# EasyEDA Pro project STM32_Temperature_Control.epro

# Schematic Schematic1
Board Name: Board1; Create Date: 2025-11-11; Page Name: P1; Project Name: 无线杯B题-智能温控; Schematic Name: Schematic1; Update Date: 2025-11-17; Company: 嘉立创EDA; Page Size: A4; Version: V1.0
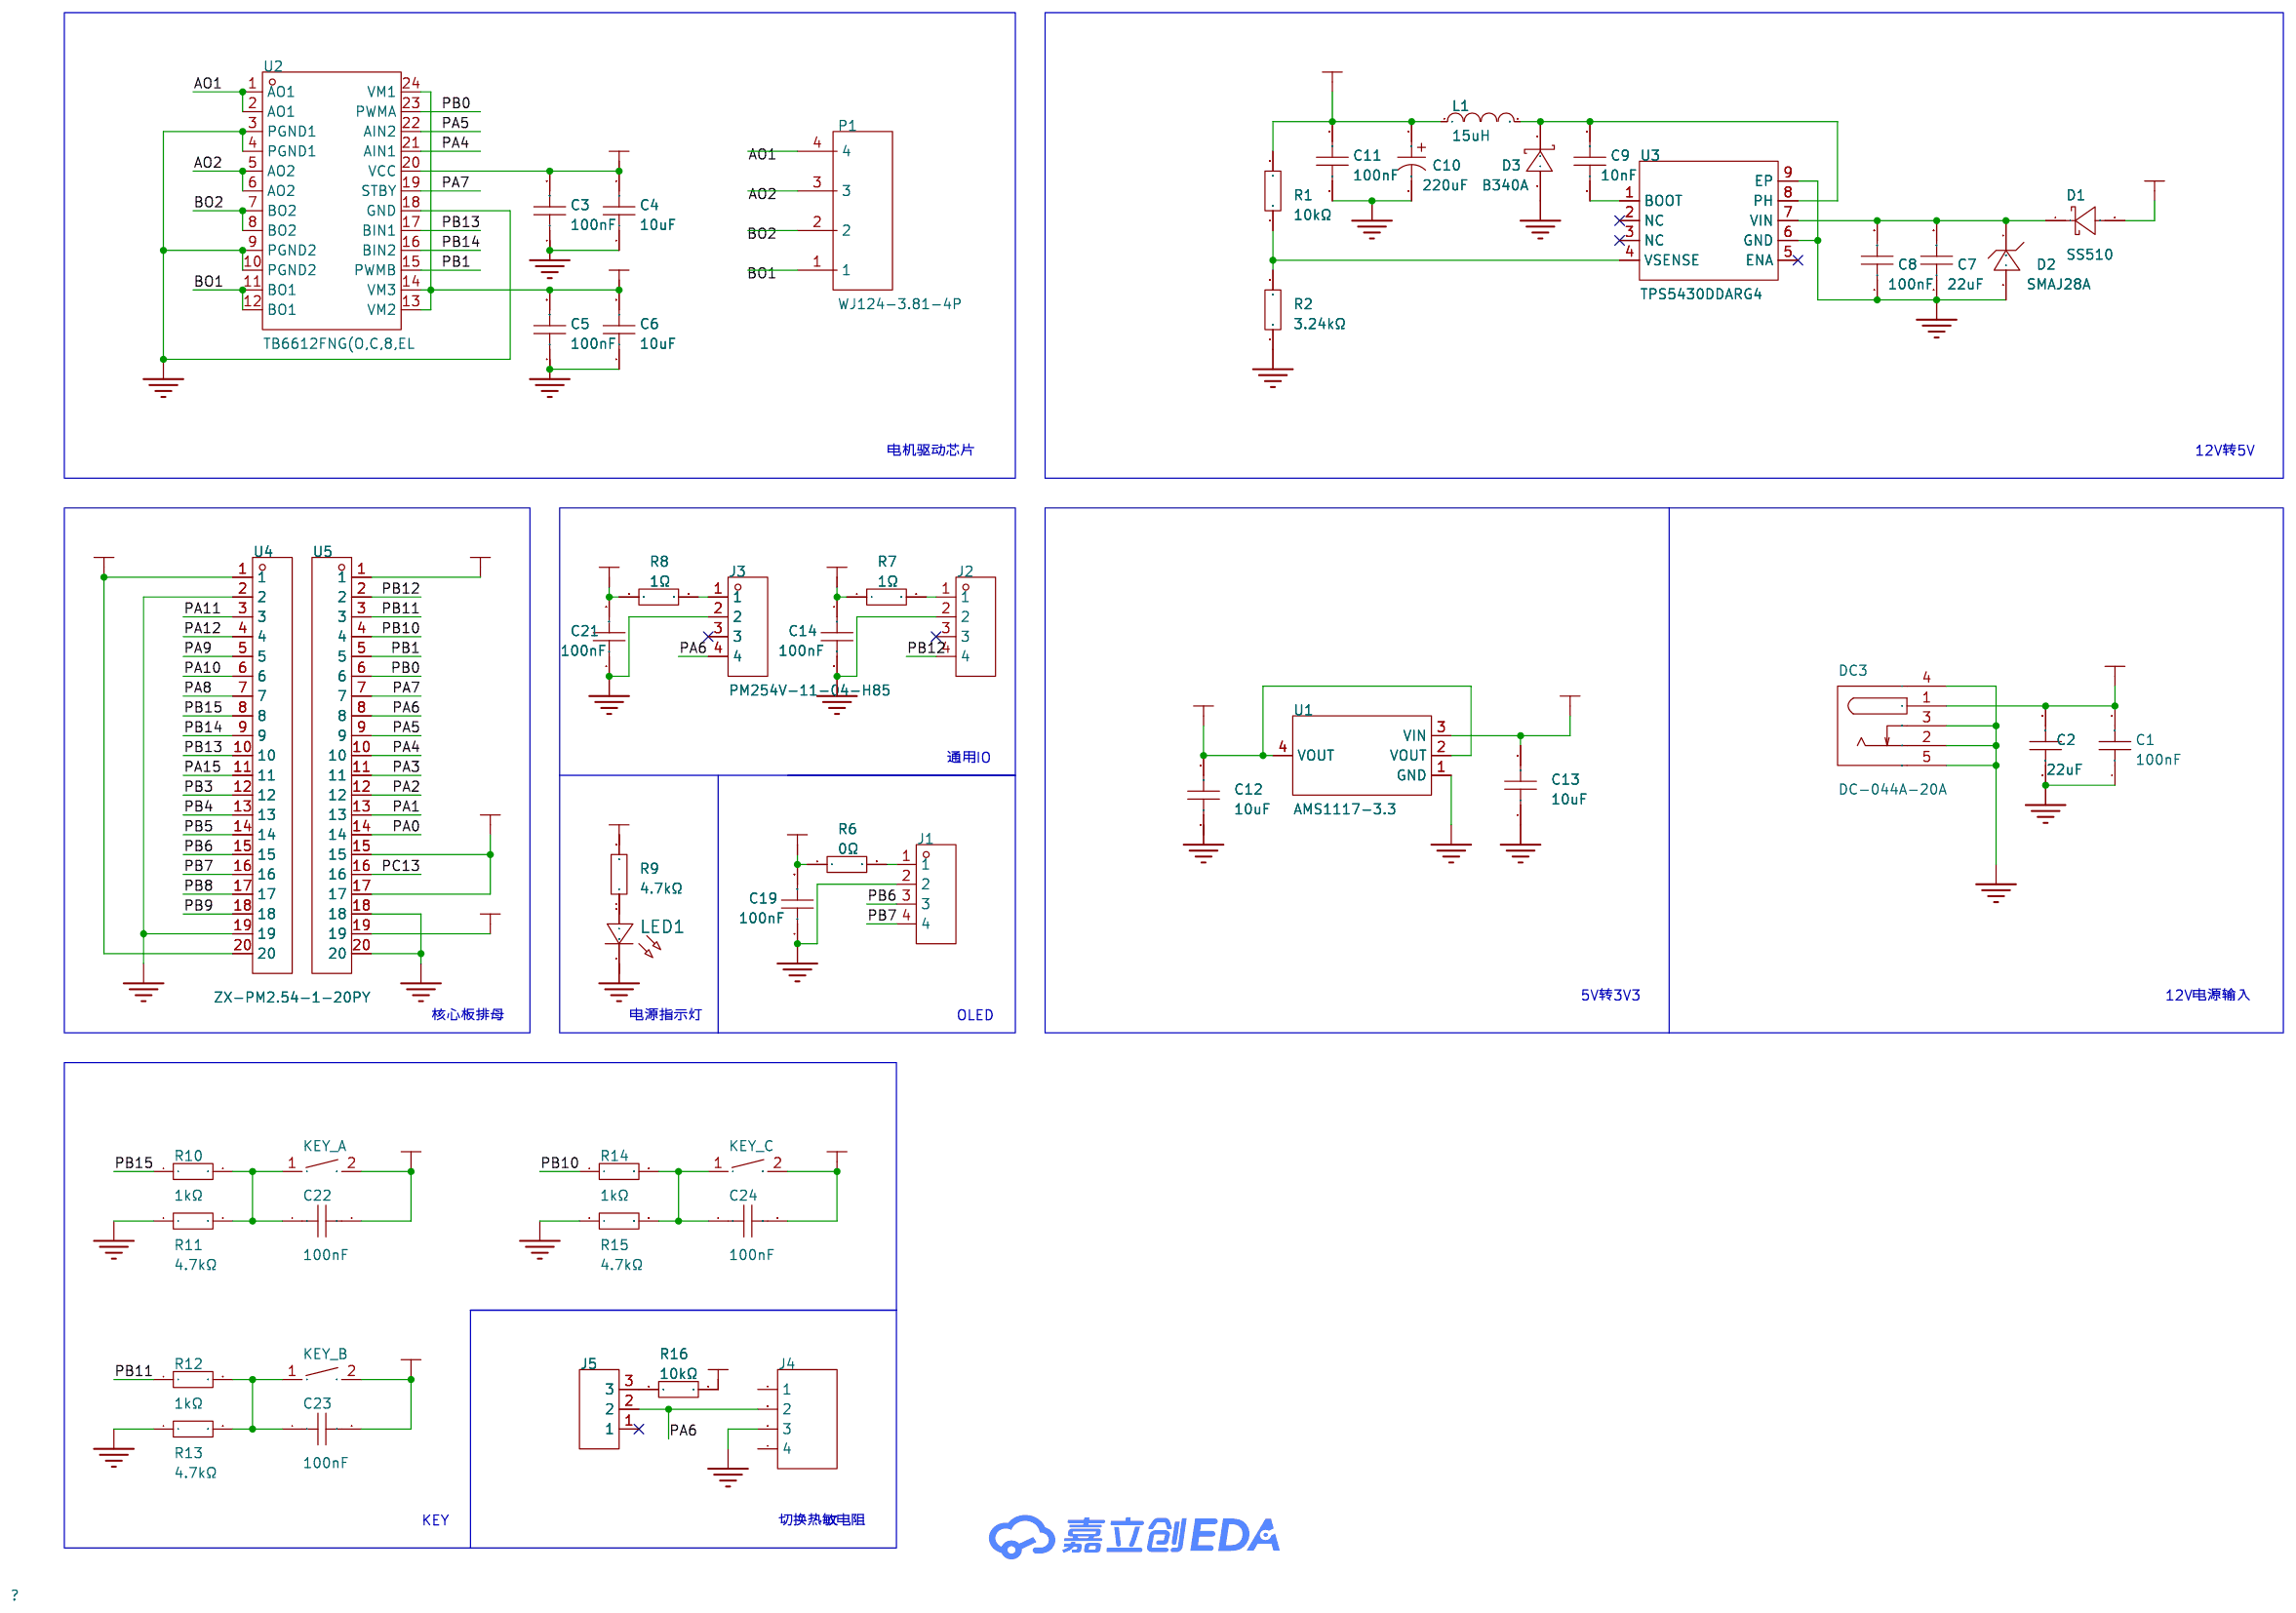
[diagram p0: schematic sheet]

## Parts
C1  100nF  [C0805]
C2  22uF  [C0805]
C3  100nF  [C0805]
C4  10uF  [C0805]
C5  100nF  [C0805]
C6  10uF  [C0805]
C7  22uF  [C0805]
C8  100nF  [C0805]
C9  10nF  [C0603]
C10  220uF  [CAP-TH_BD6.3-P2.50-D0.5-FD]
C11  100nF  [C0805]
C12  10uF  [C0805]
C13  10uF  [C0805]
C14  100nF  [C0805]
C19  100nF  [C0805]
C21  100nF  [C0805]
C22  100nF  [C0805]
C23  100nF  [C0805]
C24  100nF  [C0805]
D1  SS510  [SMB_L4.3-W3.6-LS5.4-RD]
D2  SMAJ28A  [SMA_L4.4-W2.6-LS5.0-RD]
D3  B340A  [SMA_L4.3-W2.6-LS5.1-RD]
DC3  DC-044A-20A  [DC-IN-TH_DC-044A-20A]
J1  PM254V-11-04-H85  [HDR-TH_4P-P2.54-V-F]
J2  PM254V-11-04-H85  [HDR-TH_4P-P2.54-V-F]
J3  PM254V-11-04-H85  [HDR-TH_4P-P2.54-V-F]
J4  B-2100S04P-A110  [HDR-TH_4P-P2.54-V-M]
J5  PZ254V-11-03P  [HDR-TH_3P-P2.54-V-M]
KEY_A  HX 3x4x2-2P-1.6N TACTILE SWITCH  [KEY-SMD_L4.0-W3.0-LS4.9-1]
KEY_B  HX 3x4x2-2P-1.6N TACTILE SWITCH  [KEY-SMD_L4.0-W3.0-LS4.9-1]
KEY_C  HX 3x4x2-2P-1.6N TACTILE SWITCH  [KEY-SMD_L4.0-W3.0-LS4.9-1]
L1  15uH  [IND-SMD_L7.0-W6.6_FXL0630]
LED1  LS R976-NR-1-0-20-R18  [LED0805-RD_RED]
P1  WJ124-3.81-4P  [CONN-TH_4P-P3.81_KF124-3.81-4P]
R1  10kΩ  [R0805]
R2  3.24kΩ  [R0805]
R6  0Ω  [R0603]
R7  1Ω  [R0603]
R8  1Ω  [R0603]
R9  4.7kΩ  [R0805]
R10  1kΩ  [R0805]
R11  4.7kΩ  [R0805]
R12  1kΩ  [R0805]
R13  4.7kΩ  [R0805]
R14  1kΩ  [R0805]
R15  4.7kΩ  [R0805]
R16  10kΩ  [R0805]
U1  AMS1117-3.3  [SOT-223-3_L6.5-W3.4-P2.30-LS7.0-BR]
U2  TB6612FNG(O,C,8,EL  [SSOP-24_L8.4-W5.8-P0.65-LS7.8-BL]
U3  TPS5430DDARG4  [SO-8_L4.9-W3.9-P1.27-LS6.0-BL-EP]
U4  ZX-PM2.54-1-20PY  [HDR-TH_20P-P2.54-V-F]
U5  ZX-PM2.54-1-20PY  [HDR-TH_20P-P2.54-V-F]

## Library data of the parts
C1 C3 C5 C8 C11 C14 C19 C21-C24 = CL21B104KBCNNNC: 容值:100nF;精度:±10%;额定电压:50V;温度系数:X7R;; LCSC Part Name: 100nF ±10% 50V; Supplier Part: C1711; Manufacturer: SAMSUNG(三星); Supplier Footprint: 0805; JLCPCB Part Class: Extended Part; Datasheet: https://item.szlcsc.com/datasheet/CL21B104KBCNNNC/2063.html; Supplier: LCSC; Tolerance: ±10%; Voltage Rating: 50V; Temperature Coefficient: X7R
C2 C7 = CL21A226MAQNNNE: 容值:22uF;精度:±20%;额定电压:25V;温度系数:X5R;; LCSC Part Name: 22uF ±20% 25V; Supplier Part: C45783; Manufacturer: SAMSUNG(三星); Supplier Footprint: 0805; JLCPCB Part Class: Basic Part; Datasheet: https://item.szlcsc.com/datasheet/CL21A226MAQNNNE/46786.html; Supplier: LCSC; Tolerance: ±20%; Voltage Rating: 25V; Temperature Coefficient: X5R
C4 C6 C12 C13 = GRM21BR61H106KE43L: 容值:10uF;精度:±10%;额定电压:50V;温度系数:X5R;; LCSC Part Name: 10uF ±10% 50V; Supplier Part: C440198; Manufacturer: muRata(村田); Supplier Footprint: 0805; JLCPCB Part Class: 基础库; Datasheet: https://item.szlcsc.com/datasheet/GRM21BR61H106KE43L/439567.html; Supplier: LCSC; Tolerance: ±10%; Voltage Rating: 50V; Temperature Coefficient: X5R
C9 = 0603B103K500NT: 容值:10nF;精度:±10%;额定电压:50V;温度系数:X7R;; LCSC Part Name: 10nF ±10% 50V; Supplier Part: C57112; Manufacturer: FH(风华); Supplier Footprint: 0603; JLCPCB Part Class: Basic Part; Datasheet: https://item.szlcsc.com/datasheet/0603B103K500NT/58143.html; Supplier: LCSC; Tolerance: ±10%; Voltage Rating: 50V; Temperature Coefficient: X7R
C10 = ERG25V220M6X11: 容值:220uF;精度:±20%;额定电压:25V;纹波电流:510mA@100kHz;等效串联电阻(ESR):130mΩ@100kHz;; LCSC Part Name: 220uF ±20% 25V; Supplier Part: C47344177; Manufacturer: JIERR(捷而瑞); Supplier Footprint: 插件,D6.3xL11mm; JLCPCB Part Class: 扩展库; Datasheet: https://item.szlcsc.com/datasheet/ERG25V220M6X11/49556618.html; Supplier: LCSC; Tolerance: ±20%; Voltage Rating: 25V; Ripple Current: 510mA@100kHz; Equivalent Series Resistance(ESR): 130mΩ@100kHz; Pin Spacing: 2.5mm; Diameter: 6mm; Height - Seated (Max): 11mm; Lifetime: 2000hrs@105℃; Operating Temperature: -40℃~+105℃
D1 = SS510: 二极管配置:独立式;正向压降(Vf):850mV@5A;直流反向耐压(Vr):100V;整流电流:5A;; LCSC Part Name: 电压:100V 电流:5A; Supplier Part: C2898359; Manufacturer: YFW(佑风微); Supplier Footprint: SMB; JLCPCB Part Class: 扩展库; Datasheet: https://item.szlcsc.com/datasheet/SS510/3145887.html; Supplier: LCSC; Diode Configuration: 独立式; Voltage - Forward(Vf@If): 850mV@5A; Voltage - DC Reverse(Vr): 100V; Current - Rectified: 5A; Reverse Leakage Current (Ir): 300uA@100V
D2 = SMAJ28A: 极性:单向;反向截止电压(Vrwm):28V;钳位电压:45.4V;峰值脉冲电流(Ipp):8.8A;峰值脉冲功率(Ppp):400W@10/1000us;击穿电压:31.1V;; LCSC Part Name: 单向TVS 28V截止 峰值脉冲电流：8.8A; Supplier Part: C397697; Manufacturer: AnBon(安邦); Supplier Footprint: SMA(DO-214AC); JLCPCB Part Class: 扩展库; Datasheet: https://item.szlcsc.com/datasheet/SMAJ28A/379220.html; Supplier: LCSC; Polarity: 单向; Reverse Stand-Off Voltage (Vrwm): 28V; Clamping Voltage: 45.4V; Peak Pulse Current (Ipp): 8.8A; Peak Pulse Power Dissipation (Ppp): 400W@10/1000us; Voltage - Breakdown: 31.1V; Reverse Leakage Current (Ir): 5uA; Operating Temperature: -55℃~+150℃; Type: TVS
D3 = B340A: 二极管配置:独立式;正向压降(Vf):550mV@3A;直流反向耐压(Vr):40V;整流电流:3A;; LCSC Part Name: 电压:40V 电流:3A; Supplier Part: C64982; Manufacturer: MDD(辰达半导体); Supplier Footprint: SMA(DO-214AC); JLCPCB Part Class: 扩展库; Datasheet: https://item.szlcsc.com/datasheet/B340A/66052.html; Supplier: LCSC; Diode Configuration: 独立式; Voltage - Forward(Vf@If): 550mV@3A; Voltage - DC Reverse(Vr): 40V; Current - Rectified: 3A; Reverse Leakage Current (Ir): 500uA@40V; Operating Junction Temperature Range: -50℃~+150℃
DC3 = DC-044A-20A: 连接器类型:DC电源插座;安装方式:弯插;触点内径:2mm;触点外径:5.9mm;额定电流:5A;额定电压:30V;工作温度:-20℃~+70℃;; LCSC Part Name: DC电源插座 内径:2mm 外径:5.9mm; Supplier Part: C129006; Manufacturer: 韩国韩荣; Supplier Footprint: 插件; JLCPCB Part Class: 扩展库; Datasheet: https://item.szlcsc.com/datasheet/DC-044A-20A/140292.html; Supplier: LCSC; Connector Type: DC电源插座; Mounting Type: 弯插; Inside Contact Diameter: 2mm; Outside Contact Diameter: 5.9mm; Current Rating: 5A; Voltage Rating (Max): 30V; Operating Temperature: -20℃~+70℃
J1-J3 = PM254V-11-04-H85: 插孔结构:1x4P;间距:2.54mm;行距:-;圆孔/方孔:方孔;安装方式:直插;排数:单排;总孔位数:4P;额定电流:3A;插孔方向:顶部;塑高:8.5mm;触头材质:黄铜;触头镀层:-;工作温度:-40℃~+105℃;; LCSC Part Name: 1x4P 间距:2.54mm 直插; Supplier Part: C541851; Manufacturer: XFCN(兴飞); Supplier Footprint: 插件,P=2.54mm; JLCPCB Part Class: 扩展库; Datasheet: https://item.szlcsc.com/datasheet/PM254V-11-04-H85/562472.html; Supplier: LCSC; Holes Structure: 1x4P; Pitch: 2.54mm; Circular Hole / Square Hole: 方孔; Mounting Type: 直插; Number of Rows: 单排; Number of Positions: 4P; Current Rating: 3A; Holes Direction: 顶部; Insulation Height: 8.5mm; Contact Material: 黄铜; Operating Temperature: -40℃~+105℃
J4 = B-2100S04P-A110: 插针结构:1x4P;间距:2.54mm;行距:-;圆针/方针:-;安装方式:直插;排数:单排;总PIN位数:4P;额定电流:-;额定电压:-;配合针长度:6mm;塑高:2.54mm;端接针长度:3mm;触头材质:黄铜;触头镀层:-;工作温度:-40℃~+105℃;颜色:黑色;; LCSC Part Name: 1x4P 间距:2.54mm 直插; Supplier Part: C124378; Manufacturer: Ckmtw(灿科盟); Supplier Footprint: 插件,P=2.54mm; JLCPCB Part Class: 扩展库; Datasheet: https://item.szlcsc.com/datasheet/B-2100S04P-A110/125653.html; Supplier: LCSC; Pin Structure: 1x4P; Pitch: 2.54mm; Mounting Type: 直插; Number of Rows: 单排; Number of Pins: 4P; Length of Mating Pin: 6mm; Insulation Height: 2.54mm; Length of End Connection Pin: 3mm; Contact Material: 黄铜; Operating Temperature: -40℃~+105℃; Color: 黑色
J5 = PZ254V-11-03P: 插针结构:1x3P;间距:2.54mm;行距:-;圆针/方针:方针;安装方式:直插;排数:单排;总PIN位数:3P;额定电流:3A;额定电压:250V;配合针长度:6mm;塑高:2.5mm;端接针长度:3mm;工作温度:-40℃~+105℃;颜色:黑色;; LCSC Part Name: 1x3P 间距:2.54mm 方针 直插; Supplier Part: C2937625; Manufacturer: XFCN(兴飞); Supplier Footprint: 插件,P=2.54mm; JLCPCB Part Class: 扩展库; Datasheet: https://item.szlcsc.com/datasheet/PZ254V-11-03P/3293280.html; Supplier: LCSC; Pin Structure: 1x3P; Pitch: 2.54mm; Circluar Pins/Square Pins: 方针; Mounting Type: 直插; Number of Rows: 单排; Number of Pins: 3P; Current Rating: 3A; Voltage Rating (Max): 250V; Length of Mating Pin: 6mm; Insulation Height: 2.5mm; Length of End Connection Pin: 3mm; Operating Temperature: -40℃~+105℃; Color: 黑色
KEY_A KEY_B KEY_C = HX 3x4x2-2P-1.6N TACTILE SWITCH: 电路结构:单刀单掷;按钮形状:圆形按钮;作用力:1.6N;安装方式:立贴;开关长度:4mm;开关宽度:3mm;开关高度:2mm;带支架:不带支架;触点电流:50mA;额定电压:12V;带灯:无;工作寿命:10万次;; LCSC Part Name: 4*3*2mm 立贴 轻触开关; Supplier Part: C49234124; Manufacturer: hanxia(韩下); Supplier Footprint: SMD; JLCPCB Part Class: 扩展库; Datasheet: https://item.szlcsc.com/datasheet/HX%25203x4x2-2P-1.6N%2520TACTILE%2520SWITCH/51650185.html; Supplier: LCSC; Circuit: 单刀单掷; Actuator Style: 圆形按钮; Operating Force: 1.6N; Mounting Type: 立贴; Length: 4mm; Width: 3mm; Switch Height: 2mm; with Bracket: 不带支架; Contact Current: 50mA; Voltage Rating: 12V; Actuator/Cap Color: 黑色; With Lamp: 无; Termination Style: SMD接片; Life: 10万次
L1 = FXL0630-150-M: 电感值:15uH;精度:±20%;额定电流:3A;饱和电流(Isat):4A;类型:一体成型电感;; LCSC Part Name: 15uH ±20%; Supplier Part: C177243; Manufacturer: cjiang(长江微电); Supplier Footprint: SMD,6.6x7mm; JLCPCB Part Class: 扩展库; Datasheet: https://item.szlcsc.com/datasheet/FXL0630-150-M/188635.html; Supplier: LCSC; Tolerance: ±20%; Current Rating: 3A; Current - Saturation(Isat): 4A; DC Resistance(DCR): 115mΩ; Type: 一体成型电感
LED1 = LS R976-NR-1-0-20-R18: LCSC Part Name: 0805红(雾状); Supplier Part: C2899997; Manufacturer: OSRAM(欧司朗); Supplier Footprint: 0805; JLCPCB Part Class: Extended Part; Datasheet: https://item.szlcsc.com/datasheet/LS%2520R976-NR-1-0-20-R18/3147924.html; Supplier: LCSC
P1 = WJ124-3.81-4P: 结构:1x4P;间距:3.81mm;颜色:绿色;安装方式:直插;排数:1;每排PIN数:4;额定电流:15A;额定电压:300V;线规 - AWG:14~30;线规 - 平方毫米:1.5;工作温度:-40℃~+105℃;; LCSC Part Name: 3.81mm 1x4P 排数:1 每排P数:4 直插; Supplier Part: C69809; Manufacturer: KANGNEX(康奈克斯电气); Supplier Footprint: 插件,P=3.81mm; JLCPCB Part Class: 扩展库; Datasheet: https://item.szlcsc.com/datasheet/WJ124-3.81-4P/70903.html; Supplier: LCSC; Number of Positions or Pins: 1x4P; Pitch: 3.81mm; Color: 绿色; Mounting Type: 直插; Number of Pins: 4P; Number of Rows: 1; Number of PINs Per Row: 4; Current Rating: 15A; Voltage Rating (Max): 300V; Wire Gauge - AWG: 14~30; Wire Gauge - mm2: 1.5; Operating Temperature: -40℃~+105℃
R1 R16 = 0805W8F1002T5E_C17414: 电阻类型:厚膜电阻;阻值:10kΩ;精度:±1%;功率:125mW;工作电压:150V;温度系数:±100ppm/℃;; LCSC Part Name: 10kΩ ±1% 125mW 厚膜电阻; Supplier Part: C17414; Manufacturer: UNI-ROYAL(厚声); Manufacturer Part: 0805W8F1002T5E; Supplier Footprint: 0805; JLCPCB Part Class: Basic Part; Datasheet: https://item.szlcsc.com/datasheet/0805W8F1002T5E/18102.html; Supplier: LCSC; Type: 厚膜电阻; Tolerance: ±1%; Power(Watts): 125mW; Voltage-Supply(Max): 150V; Temperature Coefficient: ±100ppm/℃; Operating Temperature: -55℃~+155℃
R2 = FRC0805F3241TS: 电阻类型:厚膜电阻;阻值:3.24kΩ;精度:±1%;功率:125mW;工作电压:150V;温度系数:±100ppm/℃;; LCSC Part Name: 3.24kΩ ±1% 125mW 厚膜电阻; Supplier Part: C2933414; Manufacturer: FOJAN(富捷); Supplier Footprint: 0805; JLCPCB Part Class: Extended Part; Supplier: LCSC; Type: 厚膜电阻; Tolerance: ±1%; Power(Watts): 125mW; Voltage-Supply(Max): 150V; Temperature Coefficient: ±100ppm/℃; Operating Temperature: -55℃~+155℃
R6 = 0603WAF0000T5E: 电阻类型:厚膜电阻;阻值:0Ω;精度:±1%;功率:100mW;工作电压:75V;温度系数:-;; LCSC Part Name: 0Ω ±1% 100mW 厚膜电阻; Supplier Part: C21189; Manufacturer: UNI-ROYAL(厚声); Supplier Footprint: 0603; JLCPCB Part Class: Basic Part; Datasheet: https://item.szlcsc.com/datasheet/0603WAF0000T5E/21903.html; Supplier: LCSC; Type: 厚膜电阻; Tolerance: ±1%; Power(Watts): 100mW; Voltage-Supply(Max): 75V; Operating Temperature: -55℃~+155℃
R7 R8 = 0603WAF100KT5E: 电阻类型:厚膜电阻;阻值:1Ω;精度:±1%;功率:100mW;工作电压:75V;温度系数:±400ppm/℃;; LCSC Part Name: 1Ω ±1% 100mW 厚膜电阻; Supplier Part: C22936; Manufacturer: UNI-ROYAL(厚声); Supplier Footprint: 0603; JLCPCB Part Class: Basic Part; Datasheet: https://item.szlcsc.com/datasheet/0603WAF100KT5E/23663.html; Supplier: LCSC; Type: 厚膜电阻; Tolerance: ±1%; Power(Watts): 100mW; Voltage-Supply(Max): 75V; Temperature Coefficient: ±400ppm/℃; Operating Temperature: -55℃~+155℃
R9 R11 R13 R15 = 0805W8F4701T5E: 电阻类型:厚膜电阻;阻值:4.7kΩ;精度:±1%;功率:125mW;最大工作电压:150V;温度系数:±100ppm/℃;; LCSC Part Name: 4.7kΩ ±1% 125mW 厚膜电阻; Supplier Part: C17673; Manufacturer: UNI-ROYAL(厚声); Supplier Footprint: 0805; JLCPCB Part Class: Basic Part; Datasheet: https://atta.szlcsc.com/upload/public/pdf/source/20200306/C422600_1E6D84923E4A46A82E41ADD87F860B5C.pdf; Supplier: LCSC; Type: 厚膜电阻; Tolerance: ±1%; Power(Watts): 125mW; Overload Voltage (Max): 150V; Temperature Coefficient: ±100ppm/℃; Operating Temperature Range: -55℃~+155℃; Voltage-Supply(Max): 150V
R10 R12 R14 = 0805W8F1001T5E: 电阻类型:厚膜电阻;阻值:1kΩ;精度:±1%;功率:125mW;最大工作电压:150V;温度系数:±100ppm/℃;; LCSC Part Name: 1kΩ ±1% 125mW 厚膜电阻; Supplier Part: C17513; Manufacturer: UNI-ROYAL(厚声); Supplier Footprint: 0805; JLCPCB Part Class: Basic Part; Datasheet: https://atta.szlcsc.com/upload/public/pdf/source/20200306/C422600_1E6D84923E4A46A82E41ADD87F860B5C.pdf; Supplier: LCSC; Type: 厚膜电阻; Tolerance: ±1%; Power(Watts): 125mW; Overload Voltage (Max): 150V; Temperature Coefficient: ±100ppm/℃; Operating Temperature Range: -55℃~+155℃
U1 = AMS1117-3.3_C6186: 输出类型:固定;工作电压:16V;输出电压:3.3V;输出电流:1A;电源纹波抑制比(PSRR):72dB@(120Hz);输出极性:正极;; LCSC Part Name: 输出3.3V 1A; Supplier Part: C6186; Manufacturer: AMS; Supplier Footprint: SOT-223; JLCPCB Part Class: 基础库; Datasheet: https://item.szlcsc.com/datasheet/AMS1117-3.3/6652.html; Supplier: LCSC; Output Type: 固定; Voltage - Supply: 16V; Output Voltage: 3.3V; Output Current: 1A; Power Supply Rejection Ratio (PSRR): 72dB@(120Hz); Voltage Dropout: 1.1V@(800mA); standby current: 5mA; Noise: 0.003%Vout; Features: 过流保护；过热保护; Operating Temperature: -40℃~+125℃; Output Configuration: 正极; Number of Outputs: 1
U2 = TB6612FNG(O,C,8,EL: 双直流电机驱动器集成电路; Supplier Part: C88224; Manufacturer: TOSHIBA(东芝); Supplier Footprint: SSOP-24-208mil; JLCPCB Part Class: 扩展库; Datasheet: https://item.szlcsc.com/datasheet/TB6612FNG(O%252CC%252C8%252CEL/89402.html; Supplier: LCSC; RDS(on): 500mΩ; Peak Current: 3.2A; Operating Temperature: -20℃~+85℃
U3 = TPS5430DDARG4: 功能类型:降压型;工作电压:5.5V~36V;输出电压:1.221V~32.04V;输出电流:3A;输出类型:可调;; LCSC Part Name: 降压 3A 36V; Supplier Part: C3192324; Manufacturer: TI(德州仪器); Supplier Footprint: SO-8-PowerPad; JLCPCB Part Class: 扩展库; Datasheet: https://www.ti.com/cn/lit/gpn/tps5431; Supplier: LCSC; Function: 降压型; Voltage - Supply: 5.5V~36V; Output Voltage: 1.221V~32.04V; Output Current: 3A; Frequency - Switching: 500kHz; Operating Temperature: -40℃~+125℃@(TJ); Synchronous Rectifier: 否; Number of Outputs: 1; Topology: 降压式; Switch tube (built-in/external): 内置; Output Type: 可调
U4 U5 = ZX-PM2.54-1-20PY: 插孔结构:1x20P;间距:2.54mm;行距:-;圆孔/方孔:方孔;安装方式:直插;排数:单排;总孔位数:20P;额定电流:3A;额定电压:-;插孔方向:顶部;塑高:8.5mm;触头材质:-;触头镀层:金;工作温度:-40℃~+105℃;; LCSC Part Name: 1x20P 间距:2.54mm 直插; Supplier Part: C7499336; Manufacturer: Megastar(兆星); Supplier Footprint: 插件,P=2.54mm; JLCPCB Part Class: 扩展库; Datasheet: https://item.szlcsc.com/datasheet/ZX-PM2.54-1-20PY/8573997.html; Supplier: LCSC; Holes Structure: 1x20P; Pitch: 2.54mm; Circular Hole / Square Hole: 方孔; Mounting Type: 直插; Number of Rows: 单排; Number of Positions: 20P; Current Rating: 3A; Holes Direction: 顶部; Insulation Height: 8.5mm; Contact Plating: 金; Operating Temperature: -40℃~+105℃; PIN Length: 3.2mm

## Nets
3V3: C3.2 C4.2 C12.2 C14.1 C19.2 C21.2 C22.2 C23.2 C24.2 KEY_A.2 KEY_B.2 KEY_C.2 R6.1 R7.1 R8.1 R9.2 R16.1 U1.2(VOUT) U1.4(VOUT) U2.20(VCC) U4.1 U4.20 U5.1 U5.15 U5.17
5V: C5.2 C6.2 C10.1 C11.1 C13.2 L1.1 R1.2 U1.3(VIN) U2.13(VM2) U2.14(VM3) U2.24(VM1)
5V_USB: U5.19
12V: C1.2 C2.2 D1.2(A) DC3.1
GND: C1.1 C2.1 C3.1 C4.1 C5.1 C6.1 C7.1 C8.1 C10.2 C11.2 C12.1 C13.1 C14.2 C19.1 C21.1 D2.2(A) D3.2(A) DC3.2 DC3.3 DC3.4 DC3.5 J1.2 J2.2 J3.2 J4.3 LED1.1(C) R2.1 R11.1 R13.1 R15.1 U1.1(GND) U2.3(PGND1) U2.4(PGND1) U2.9(PGND2) U2.10(PGND2) U2.18(GND) U3.6(GND) U3.9(EP) U4.2 U4.19 U5.18 U5.20
AO1: P1.4 U2.1(AO1) U2.2(AO1)
AO2: P1.3 U2.5(AO2) U2.6(AO2)
BO1: P1.1 U2.11(BO1) U2.12(BO1)
BO2: P1.2 U2.7(BO2) U2.8(BO2)
PA0: U5.14
PA1: U5.13
PA2: U5.12
PA3: U5.11
PA4: U2.21(AIN1) U5.10
PA5: U2.22(AIN2) U5.9
PA6: J3.4 J4.2 J5.2 U5.8
PA7: U2.19(STBY) U5.7
PA8: U4.7
PA9: U4.5
PA10: U4.6
PA11: U4.3
PA12: U4.4
PA15: U4.11
PB0: U2.23(PWMA) U5.6
PB1: U2.15(PWMB) U5.5
PB3: U4.12
PB4: U4.13
PB5: U4.14
PB6: J1.3 U4.15
PB7: J1.4 U4.16
PB8: U4.17
PB9: U4.18
PB10: R14.1 U5.4
PB11: R12.1 U5.3
PB12: J2.4 U5.2
PB13: U2.17(BIN1) U4.10
PB14: U2.16(BIN2) U4.9
PB15: R10.1 U4.8
PC13: U5.16
$1N4535: C7.2 C8.2 D1.1(K) D2.1(C) U3.7(VIN)
$1N4661: C9.1 U3.1(BOOT)
$1N4713: C9.2 D3.1(K) L1.2 U3.8(PH)
$1N5432: R1.1 R2.2 U3.4(VSENSE)
$1N8913: J1.1 R6.2
$1N9223: J2.1 R7.2
$1N9361: J3.1 R8.2
$1N9905: LED1.2(A) R9.1
$1N10187: C22.1 KEY_A.1 R10.2 R11.2
$1N10465: C23.1 KEY_B.1 R12.2 R13.2
$1N10622: C24.1 KEY_C.1 R14.2 R15.2
$1N14799: J5.3 R16.2

Not connected (* = marked no-connect by the designer): J2 3*; J3 3*; J4 1 4; J5 1*; U3 2(NC)* 3(NC)* 5(ENA)*

## Notes on the sheet
- 电机驱动芯片
- 12V转5V
- 通用IO
- 5V转3V3
- 12V电源输入
- 核心板排母
- 电源指示灯
- OLED
- KEY
- 切换热敏电阻

# Board PCB4
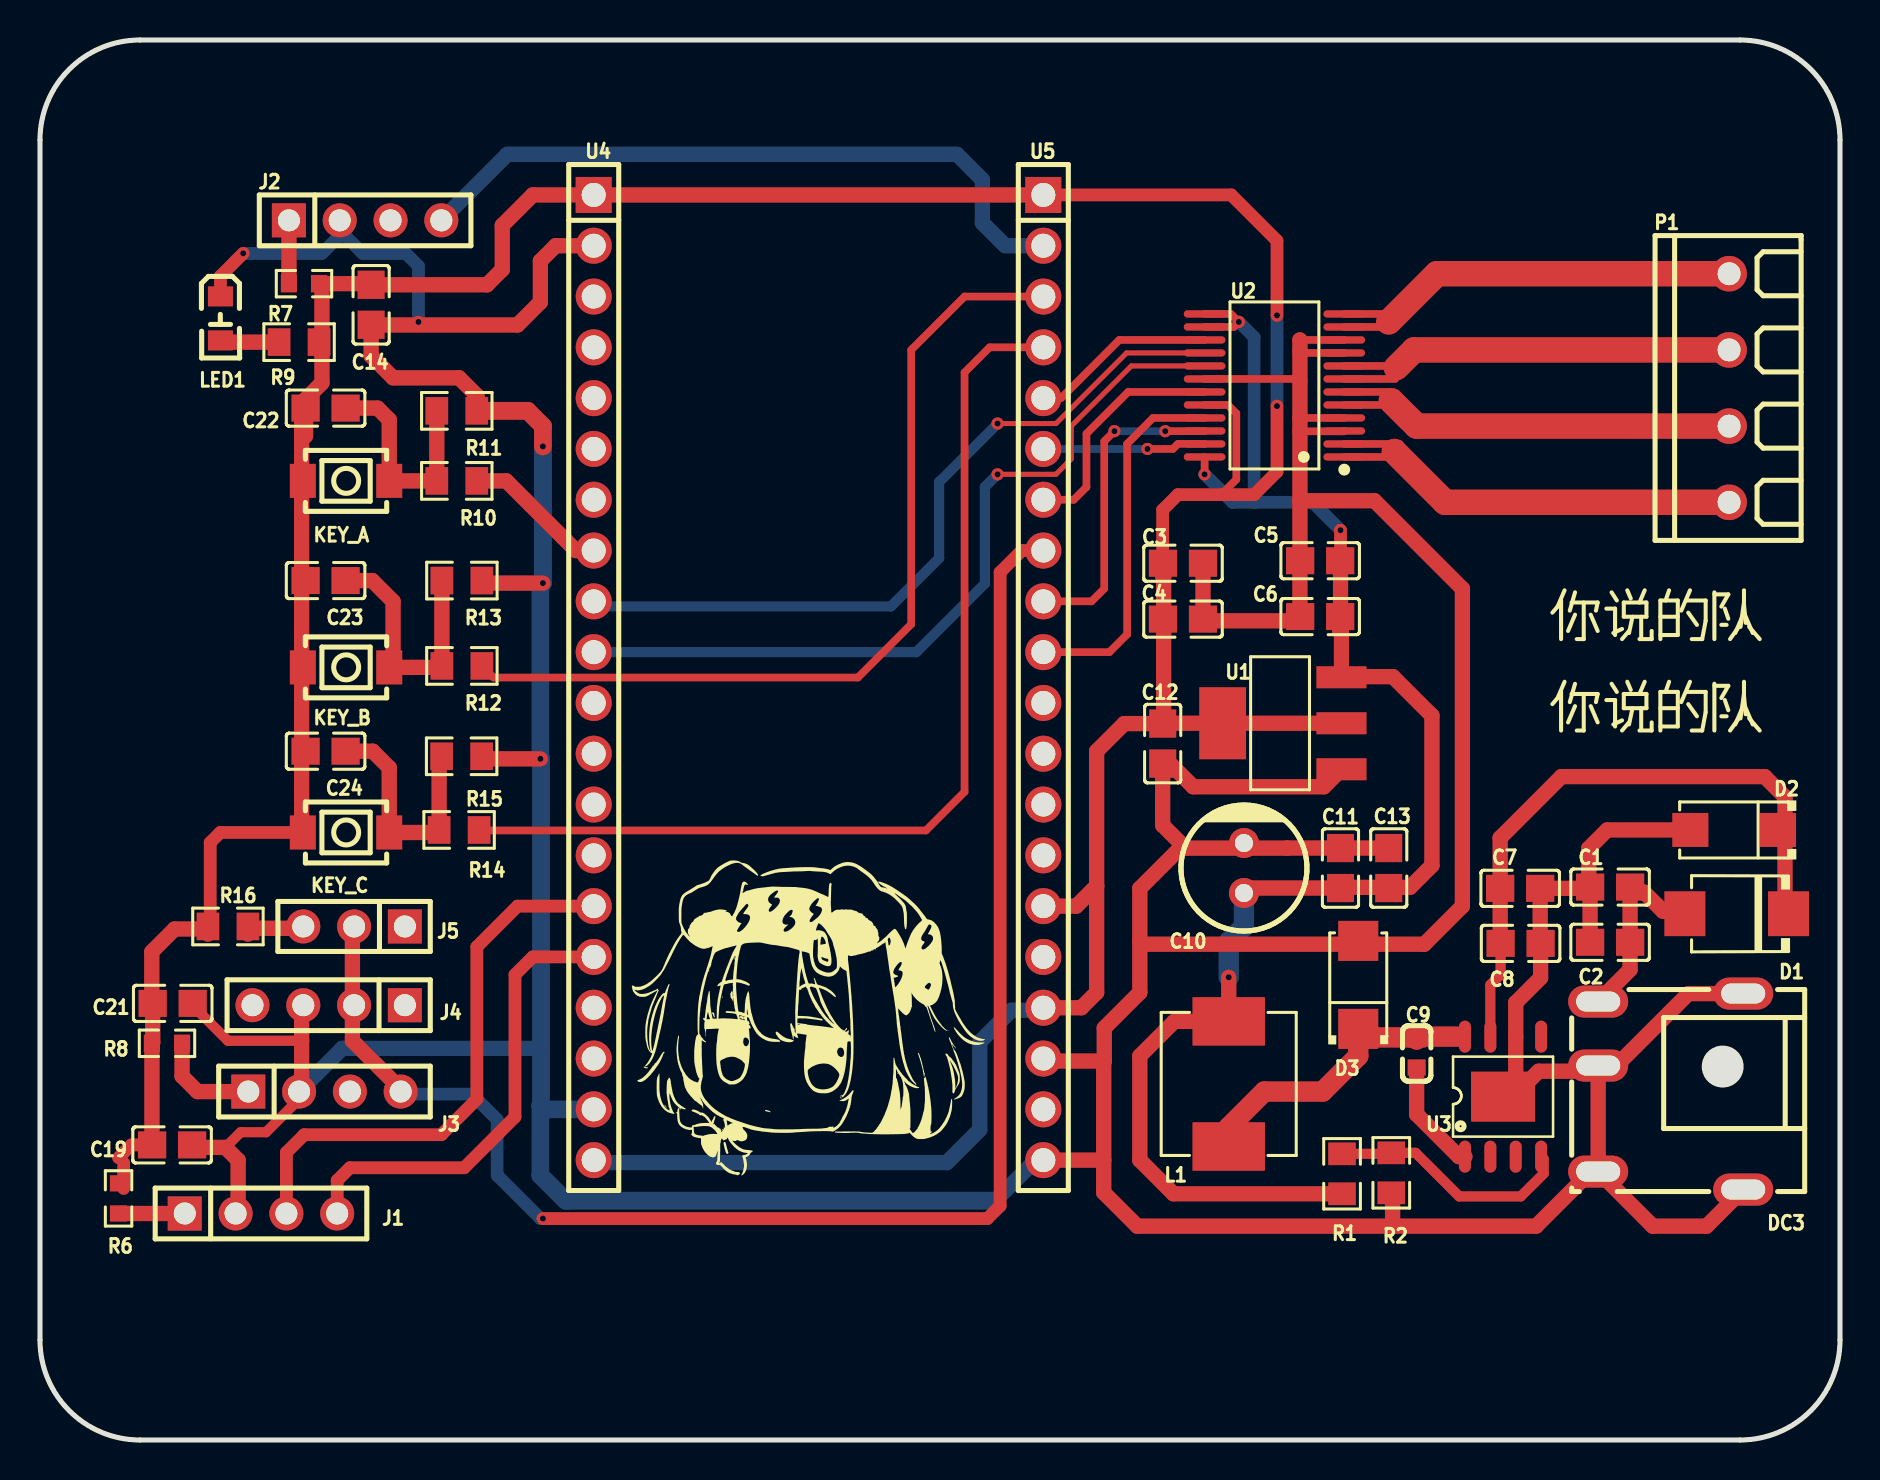
[diagram p1: board, top side]
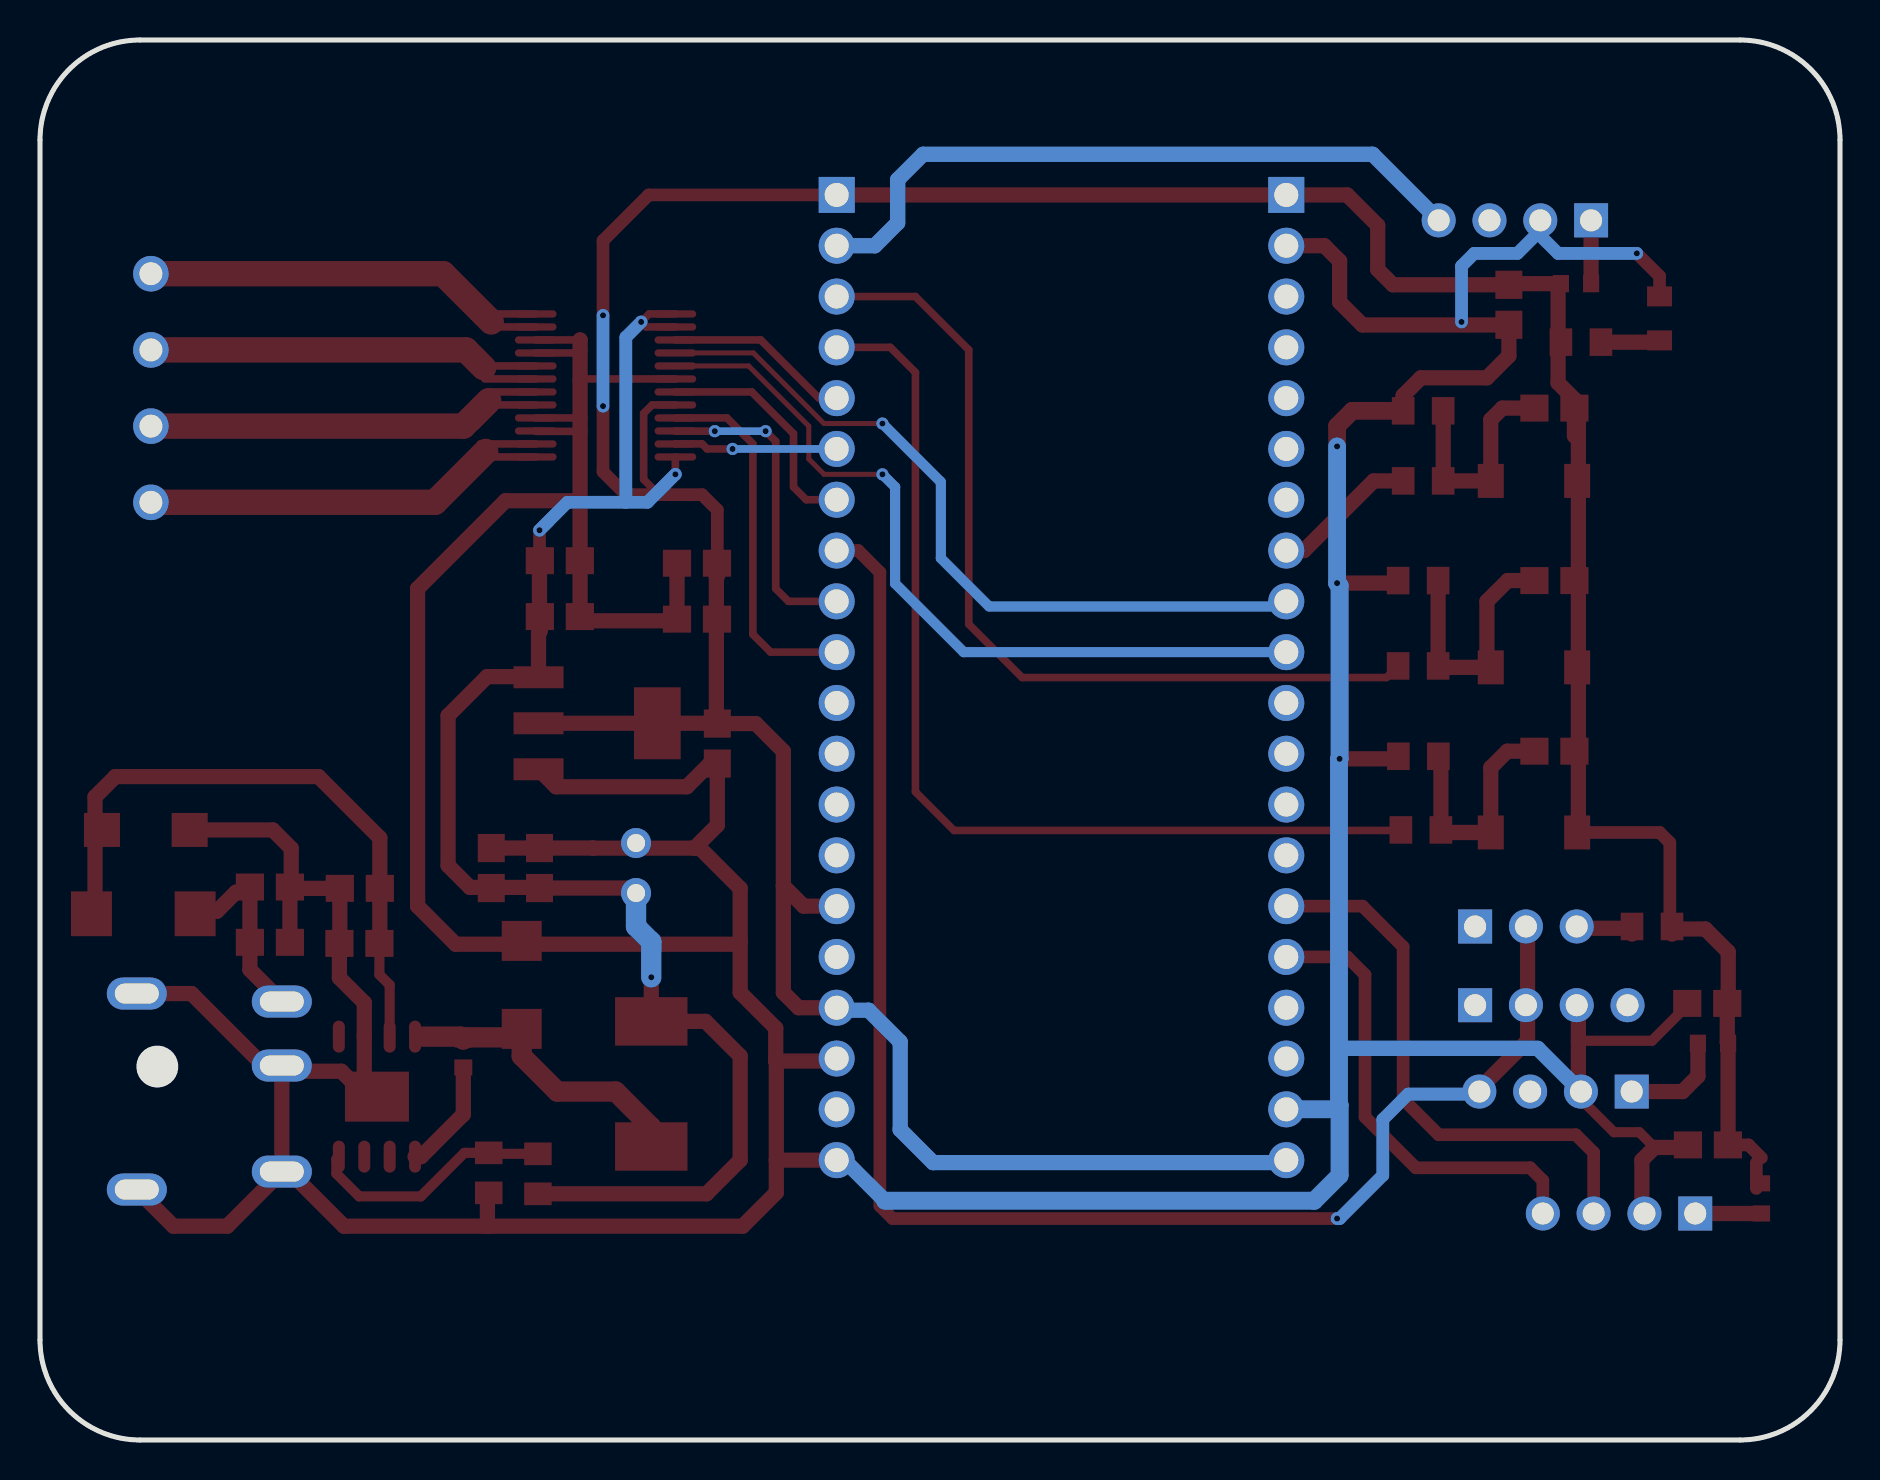
[diagram p2: board, bottom side, seen from below]

Outline 90 x 70 mm; copper layers: Top Layer, Bottom Layer. Coordinates in mm from the lower left corner of the outline.
Outline path: 0,65 0,5 arc(1.46,1.46) 5,0 85,0 arc(88.54,1.46) 90,5 90,65 arc(88.54,68.54) 85,70 5,70 arc(1.46,68.54) 0,65
Stack: Top Layer 0.035mm / Dielectric1 1.51mm FR4 er 4.5 / Bottom Layer 0.035mm

## Design rules (mm)
template: 自定义配置
spacing copperThickness1oz (default): track to track 0.102, other pairs 0.152 to 0.3
spacing copperThickness2oz: track to track 0.203, other pairs 0.152 to 0.3
track width copperThickness1oz: min 0.127, default 0.254, max 2.54
track width copperThickness2oz (default): min 0.203, default 0.635, max 2.54
differential pair differentialPair (default): width min 0.127, default 0.254, max 2.54; gap min 0.152, default 0.152
via viaSize (default): diameter min 0.5, default 0.61, max 10; hole min 0.3, default 0.305, max 6.3

## Placement (name value [footprint] x y rotation side)
C1  100nF  [C0805]  78.5 27.65 0 top
C2  22uF  [C0805]  78.5 24.88 0 top
C3  100nF  [C0805]  57.15 43.84 180 top
C4  10uF  [C0805]  57.15 41.04 180 top
C5  100nF  [C0805]  64.01 43.97 0 top
C6  10uF  [C0805]  64.01 41.17 0 top
C7  22uF  [C0805]  74.01 27.58 180 top
C8  100nF  [C0805]  74.03 24.83 180 top
C9  10nF  [C0603]  68.83 19.33 90 top
C10  220uF  [CAP-TH_BD6.3-P2.50-D0.5-FD]  60.2 28.6 90 top
C11  100nF  [C0805]  65.02 28.6 90 top
C12  10uF  [C0805]  56.13 34.82 90 top
C13  10uF  [C0805]  67.44 28.6 270 top
C14  100nF  [C0805]  16.56 56.76 270 top
C19  100nF  [C0805]  6.6 14.75 180 top
C21  100nF  [C0805]  6.64 21.83 180 top
C22  100nF  [C0805]  14.28 51.59 180 top
C23  100nF  [C0805]  14.28 42.97 180 top
C24  100nF  [C0805]  14.28 34.44 180 top
D1  SS510  [SMB_L4.3-W3.6-LS5.4-RD]  84.84 26.31 180 top
D2  SMAJ28A  [SMA_L4.4-W2.6-LS5.0-RD]  84.71 30.5 180 top
D3  B340A  [SMA_L4.3-W2.6-LS5.1-RD]  65.91 22.76 90 top
DC3  DC-044A-20A  [DC-IN-TH_DC-044A-20A]  81.53 17.42 180 top
J1  PM254V-11-04-H85  [HDR-TH_4P-P2.54-V-F]  11.05 11.33 0 top
J2  PM254V-11-04-H85  [HDR-TH_4P-P2.54-V-F]  16.26 60.98 0 top
J3  PM254V-11-04-H85  [HDR-TH_4P-P2.54-V-F]  14.22 17.42 0 top
J4  B-2100S04P-A110  [HDR-TH_4P-P2.54-V-M]  14.43 21.74 180 top
J5  PZ254V-11-03P  [HDR-TH_3P-P2.54-V-M]  15.7 25.68 180 top
KEY_A  HX 3x4x2-2P-1.6N TACTILE SWITCH  [KEY-SMD_L4.0-W3.0-LS4.9-1]  15.3 47.96 180 top
KEY_B  HX 3x4x2-2P-1.6N TACTILE SWITCH  [KEY-SMD_L4.0-W3.0-LS4.9-1]  15.3 38.63 180 top
KEY_C  HX 3x4x2-2P-1.6N TACTILE SWITCH  [KEY-SMD_L4.0-W3.0-LS4.9-1]  15.3 30.38 180 top
L1  15uH  [IND-SMD_L7.0-W6.6_FXL0630]  59.44 17.8 90 top
LED1  LS R976-NR-1-0-20-R18  [LED_0805]  9.02 56.03 270 top
P1  WJ124-3.81-4P  [CONN-TH_4P-P3.81_KF124-3.81-4P]  84.46 52.6 0 top
R1  10kΩ  [R0805]  65.1 13.31 270 top
R2  3.24kΩ  [R0805]  67.56 13.36 90 top
R6  0Ω  [R0603]  3.93 12.08 270 top
R7  1Ω  [R0603]  13.2 57.82 180 top
R8  1Ω  [R0603]  6.35 19.83 0 top
R9  4.7kΩ  [R0805]  12.95 54.89 0 top
R10  1kΩ  [R0805]  20.84 47.96 180 top
R11  4.7kΩ  [R0805]  20.84 51.46 180 top
R12  1kΩ  [R0805]  21.09 38.7 180 top
R13  4.7kΩ  [R0805]  21.09 42.97 180 top
R14  1kΩ  [R0805]  20.95 30.5 180 top
R15  4.7kΩ  [R0805]  21.08 34.19 180 top
R16  10kΩ  [R0805]  9.4 25.68 0 top
U1  AMS1117-3.3  [SOT-223-3_L6.5-W3.4-P2.30-LS7.0-BR]  62.1 35.84 0 top
U2  TB6612FNG(O,C,8,EL  [SSOP-24_L8.4-W5.8-P0.65-LS7.8-BL]  61.72 52.73 90 top
U3  TPS5430DDARG4  [SO-8_L4.9-W3.9-P1.27-LS6.0-BL-EP]  73.15 17.17 0 top
U4  ZX-PM2.54-1-20PY  [HDR-TH_20P-P2.54-V-F]  27.69 38.12 270 top
U5  ZX-PM2.54-1-20PY  [HDR-TH_20P-P2.54-V-F]  50.17 38.12 270 top

## Footprints (pads in the part's own frame, mm; a bottom-side part is the same pattern mirrored in y, then rotated)
C0603
  rect 0.8x0.9 smd: 1(-0.7,0) 2(0.7,0)
C0805
  rect 1.41x1.35 smd: 1(-1,0) 2(1,0)
CAP-TH_BD6.3-P2.50-D0.5-FD
  round 1.5 hole 0.9: 1(-1.25,0) 2(1.25,0)
CONN-TH_4P-P3.81_KF124-3.81-4P
  round 1.778 hole 1.143: 1(0,5.715) 2(0,1.905) 3(0,-1.905) 4(0,-5.715)
DC-IN-TH_DC-044A-20A
  oval 3x1.6 hole 2.2x1: 1(3.625,-4.5) 2(3.625,4.001) 3(3.625,-1.3) 4(-3.625,-4.9) 5(-3.625,4.9)
HDR-TH_3P-P2.54-V-M
  rect 1.7x1.7 hole 1.1: 1(-2.54,0)
  round 1.7 hole 1.1: 2(0,0) 3(2.54,0)
HDR-TH_4P-P2.54-V-F
  rect 1.7x1.7 hole 1.1: 1(-3.81,0)
  round 1.7 hole 1.1: 2(-1.27,0) 3(1.27,0) 4(3.81,0)
HDR-TH_4P-P2.54-V-M
  rect 1.7x1.7 hole 1.1: 1(-3.81,0)
  round 1.7 hole 1.1: 2(-1.27,0) 3(1.27,0) 4(3.81,0)
HDR-TH_20P-P2.54-V-F
  rect 1.8x1.8 hole 1.2: 1(-24.13,0)
  round 1.8 hole 1.2: 2(-21.59,0) 3(-19.05,0) 4(-16.51,0) 5(-13.97,0) 6(-11.43,0) 7(-8.89,0) 8(-6.35,0) 9(-3.81,0) 10(-1.27,0) 11(1.27,0) 12(3.81,0) 13(6.35,0) 14(8.89,0) 15(11.43,0) 16(13.97,0) 17(16.51,0) 18(19.05,0) 19(21.59,0) 20(24.13,0)
IND-SMD_L7.0-W6.6_FXL0630
  rect 2.424x3.62 smd: 1(3.128,0) 2(-3.128,0)
KEY-SMD_L4.0-W3.0-LS4.9-1
  rect 1.3x1.7 smd: 1(-2.159,0) 2(2.159,0)
LED_0805
  rect 1x1.25 smd: 1(-1.15,0.005) 2(1.05,0.005)
R0603
  rect 0.806x0.864 smd: 1(-0.753,0) 2(0.753,0)
R0805
  rect 1.133x1.377 smd: 1(-1,0) 2(1,0)
SMA_L4.3-W2.6-LS5.1-RD
  rect 2x2 smd: 1(-2.2,0) 2(2.2,0)
SMA_L4.4-W2.6-LS5.0-RD
  rect 1.8x1.7 smd: 1(-2.192,0) 2(2.192,0)
SMB_L4.3-W3.6-LS5.4-RD
  rect 2.047x2.241 smd: 1(-2.591,0) 2(2.591,0)
SO-8_L4.9-W3.9-P1.27-LS6.0-BL-EP
  oval 0.6x1.6 smd: 1(-1.905,-3) 2(-0.635,-3) 3(0.635,-3) 4(1.905,-3) 5(1.905,3) 6(0.635,3) 7(-0.635,3) 8(-1.905,3)
  rect 3.2x2.5 smd: 9(0,0)
SOT-223-3_L6.5-W3.4-P2.30-LS7.0-BR
  rect 2.5x1.1 smd: 1(2.97,-2.3) 2(2.97,0) 3(2.97,2.3)
  rect 2.34x3.6 smd: 4(-2.97,0)
SSOP-24_L8.4-W5.8-P0.65-LS7.8-BL
  oval 0.364x2.082 smd: 1(-3.575,-3.491) 2(-2.925,-3.491) 3(-2.275,-3.491) 4(-1.625,-3.491) 5(-0.975,-3.491) 6(-0.325,-3.491) 7(0.325,-3.491) 8(0.975,-3.491) 9(1.625,-3.491) 10(2.275,-3.491) 11(2.925,-3.491) 12(3.575,-3.491) 13(3.575,3.491) 14(2.925,3.491) 15(2.275,3.491) 16(1.625,3.491) 17(0.975,3.491) 18(0.325,3.491) 19(-0.325,3.491) 20(-0.975,3.491) 21(-1.625,3.491) 22(-2.275,3.491) 23(-2.925,3.491) 24(-3.575,3.491)

## Nets
As in the schematic.

Pads without a net: J2 3; J3 3; J4 1 4; J5 1; U3 2 3 5

## Via types
v1: diameter 0.61, hole 0.305, Top Layer to Bottom Layer, 17 vias

## Routing (per net, layer and track width the routed paths; a pad name or vN(x,y) marks a point on that pad's centre or on a via; arc(x,y) is an arc through that point)
3V3: length 200.3
  Top Layer w0.381: U2.20 59.4,51.75 59.82,51.33 59.82,48.03 59.06,47.27 ; 56.13,43.57 56.13,43.57
  Top Layer w0.635: 4.18,13.86 4.18,12.58 ; 5.73,14.75 4.57,14.75 3.93,14.11 ; v1(61.85,56.23) 61.85,59.97 59.56,62.25 U5.1 ; KEY_C.2 9.02,30.38 8.51,29.87 8.51,25.41 8.4,25.3 ; v1(61.85,51.69) 61.85,48.41 60.71,47.27 56.9,47.27 56.13,46.5 56.13,43.57
  Top Layer w0.762: 56.15,35.84 56.18,35.87 56.18,43.13 56.13,43.19 ; 56.15,35.84 U1.4 U1.2 ; 56.15,35.84 C12.2 54.21,35.82 52.83,34.44 52.83,27.71 ; 8.4,25.3 8.14,25.55 6.73,25.55 5.59,24.41 5.59,21.88 C21.2 5.64,19.87 R8.1 5.6,15.15 ; 52.83,27.71 52.83,22.38 52.07,21.61 U5.17 ; 52.83,27.71 51.82,26.69 50.17,26.69 ; U5.1 U4.1 24.64,62.25 23.11,60.73 23.11,58.52 22.35,57.76 C14.1 16.5,57.82 R7.1 14.1,57.67 14.1,52.86 13.28,52.04 13.28,50.2 ; 13.08,51.46 13.08,30.44
  Bottom Layer w0.635: v1(61.85,51.69) v1(61.85,56.23)
  Bottom Layer w0.762: U5.17 50.04,21.49 48.57,21.49 46.99,19.91 46.99,15.52 45.34,13.87 27.81,13.87 27.69,13.99
5V: length 79
  Top Layer w0.381: U2.13 59.54,56.3 v1(59.94,55.9) 59.69,55.65 U2.14 ; v1(58.23,48.28) U2.24
  Top Layer w0.635: v1(65.02,45.49) 65.02,43.5 65.03,43.5
  Top Layer w0.762: C10.1 60.45,27.6 C11.1 ; 65.15,27.63 68.5,27.63 69.6,28.72 69.6,36.22 67.65,38.17 65.87,38.17 ; v1(59.44,23.14) L1.1 56.72,20.93 54.99,19.2 54.99,13.99 56.67,12.31 R1.2 ; U1.3 65.07,40.35 65,40.43 65,40.75 65.03,40.78 65.03,43.5
  Bottom Layer w0.635: v1(58.23,48.28) 59.63,46.89 60.71,46.89 ; v1(65.02,45.49) 63.63,46.89 60.71,46.89 ; 60.71,46.89 60.71,55.14 v1(59.94,55.9)
  Bottom Layer w1.016: C10.1 60.2,25.68 59.44,24.92 v1(59.44,23.14)
12V: length 9.5
  Top Layer w0.762: 82.5,26.44 81.15,26.44 80.2,27.39 79.5,27.39 C2.2 79.5,23.52 DC3.1
GND: length 356.3
  Top Layer w0.381: 63,50.43 65.19,50.43 65.21,50.45 ; 63,54.47 63.21,54.26 63.3,54.35 65.21,54.35 ; U2.18 62.9,53.05 63,52.96 ; 63,51.09 63.01,51.1 65.21,51.1 ; 65.21,55 62.99,55
  Top Layer w0.508: C21.1 7.64,21.72 9.4,19.96 13.08,19.96 ; 9.27,14.63 10.03,15.39 11.3,15.39 12.95,17.04 J3.2 ; 63,43.53 62.96,43.57
  Top Layer w0.635: LED1.1 9.02,58.19 v1(10.16,59.33)
  Top Layer w0.762: 58.52,40.77 58.72,40.96 62.85,40.96 63,41.11 63,46.96 ; 53.18,13.99 53.18,18.92 53.21,18.95 ; 53.18,13.99 50.17,13.99 ; 53.18,13.99 53.18,12.37 54.86,10.69 67.63,10.69 ; 53.21,18.95 53.21,20.6 54.99,22.38 54.99,24.94 ; 53.21,18.95 50.29,18.95 50.17,19.07 ; DC3.2 77.53,13.42 74.8,10.69 67.63,10.69 ; DC3.2 80.64,10.69 83.33,10.69 DC3.5 ; DC3.2 DC3.3 ; 57.28,29.59 62.35,29.59 62.36,29.6 C11.2 67.06,29.6 ; 57.28,29.59 56.13,30.74 C12.1 56.5,33.82 57.66,32.66 64.2,32.66 U1.1 ; 57.28,29.59 57,29.59 54.99,27.58 54.99,24.94 ; 13.08,21.74 13.08,17.55 J3.2 ; DC3.3 78.82,18.72 82.42,22.32 DC3.4 ; DC3.3 77.62,18.44 74.93,18.44 73.79,17.3 ; 21.84,51.46 21.84,52.22 20.95,53.11 17.65,53.11 16.56,54.21 C14.2 16.57,55.75 23.88,55.75 25.02,56.89 25.02,58.95 25.78,59.71 27.69,59.71 ; R13.1 22.22,42.84 v1(25.15,42.84) ; 63,46.96 66.72,46.96 71.12,42.57 71.12,26.69 69.22,24.79 55.15,24.79 54.99,24.94 ; 63,46.96 63,55 62.99,55 ; 77.44,27.58 77.44,29.58 78.36,30.5 83.02,30.5 ; 77.44,27.58 C1.1 C2.1 77.45,24.83 ; 77.44,27.58 C7.1 75.01,24.85 C8.1 75.03,23.11 73.79,21.87 73.79,17.8 ; J1.2 9.91,11.45 9.91,13.99 9.27,14.63 8,14.63 ; 67.63,10.69 67.63,12.29 R2.1 ; v1(25.02,34.06) 22.21,34.06 R15.1 ; 73.53,17.55 U3.9 ; C3.1 C4.1
  Top Layer w0.889: v1(25.15,49.68) 25.15,50.7 24.38,51.46 21.84,51.46
  Bottom Layer w0.635: v1(10.16,59.33) 14.1,59.33 14.99,60.22 14.99,60.47 ; 14.99,60.47 16.13,59.33 18.29,59.33 18.92,58.7 v1(18.92,55.9) ; 14.99,60.47 J2.2
  Bottom Layer w0.762: 25.05,19.59 25.04,19.58 15.11,19.58 J3.2 ; 47.75,11.96 49.78,13.99 50.17,13.99
  Bottom Layer w0.889: 25.02,16.74 25.05,16.77 25.05,34.03 v1(25.02,34.06) 25.02,42.72 v1(25.15,42.84) v1(25.15,49.68) ; 25.02,16.74 25.22,16.53 U4.19 ; 25.02,16.74 25.02,13.23 26.29,11.96 47.75,11.96
AO1: length 23.1
  Top Layer w0.381: 65.21,49.8 67.98,49.8 ; 65.21,49.15 67.71,49.15
  Top Layer w1.27: 67.71,49.43 70.26,46.88 P1.4
AO2: length 23.2
  Top Layer w0.381: 68.2,50.7 67.31,51.58 67.31,51.71 ; 65.21,52.4 67.51,52.4 ; 65.21,51.75 67.27,51.75
  Top Layer w1.27: P1.3 68.84,50.69 67.56,51.97
BO1: length 22.7
  Top Layer w0.381: 65.21,56.3 67.46,56.3 ; 84.45,58.32 P1.1 ; 67.69,55.65 65.21,55.65
  Top Layer w1.27: P1.1 69.85,58.31 67.44,55.9
BO2: length 21.9
  Top Layer w0.381: 65.21,53.05 67.76,53.05 ; 65.21,53.7 67.52,53.7
  Top Layer w1.27: 67.82,53.62 68.71,54.5 P1.2
PA4: length 18.5
  Top Layer w0.381: U5.10 53.47,39.39 54.36,40.28 54.36,49.81 55.65,51.1 U2.21
PA5: length 15.9
  Top Layer w0.381: U2.22 58.22,50.44 v1(56.26,50.44) ; U5.9 52.58,41.93 53.21,42.57 53.21,49.93 v1(53.72,50.44)
  Bottom Layer w0.381: v1(53.72,50.44) v1(56.26,50.44)
PA6: length 77.5
  Top Layer w0.635: v1(25.15,11.07) 47.37,11.07 48.01,11.71 48.01,43.39 49.09,44.47 U5.8
  Top Layer w0.762: 15.62,25.3 15.62,19.96 17.91,17.68
  Bottom Layer w0.635: 18.03,17.8 18.54,17.3 21.59,17.3 22.86,16.03 22.86,13.23 25.02,11.07 v1(25.15,11.07)
PA7: length 11.9
  Top Layer w0.381: 58.23,52.4 54.41,52.4 52.32,50.31 52.32,47.65 51.69,47.01 U5.7
PB0: length 8.2
  Top Layer w0.381: v1(55.37,49.55) 56.64,49.55 56.9,49.81 58.23,49.81 U2.23
  Bottom Layer w0.381: U5.6 v1(55.37,49.55)
PB1: length 9.3
  Top Layer w0.381: U5.5 51.05,52.09 53.96,55 U2.15
PB6: length 28
  Top Layer w0.635: J1.3 12.32,14.37 13.21,15.26 20.07,15.26 21.84,17.04 21.84,24.66 23.88,26.69 27.69,26.69
PB7: length 23.3
  Top Layer w0.635: U4.16 24.64,24.15 23.75,23.26 23.75,16.15 21.21,13.61 15.49,13.61 14.86,12.98 J1.4
PB10: length 50.5
  Top Layer w0.381: R14.1 21.98,30.48 44.3,30.48 46.23,32.41 46.23,53.38 47.48,54.63 50.17,54.63
PB11: length 44.2
  Top Layer w0.381: U5.3 46.23,57.17 43.56,54.51 43.56,40.79 40.89,38.12 22.68,38.12 R12.1
PB12: length 34.6
  Bottom Layer w0.762: J2.4 23.37,64.28 45.85,64.28 47.12,63.02 47.12,60.86 48.26,59.71 50.17,59.71
PB13: length 40.3
  Top Layer w0.254: v1(47.88,48.28) 50.79,48.28 51.56,49.05 51.56,50.7 54.57,53.7 58.23,53.7
  Bottom Layer w0.508: U4.10 43.81,39.39 47.24,42.82 47.24,47.65 v1(47.88,48.28)
PB14: length 38.1
  Top Layer w0.254: v1(47.88,50.82) 50.8,50.82 54.33,54.35 U2.16
  Bottom Layer w0.508: v1(47.88,50.82) 44.96,47.9 44.96,44.09 42.54,41.68 27.94,41.68 U4.9
PB15: length 7.3
  Top Layer w0.762: R10.1 23.31,47.96 26.8,44.47 U4.8
$1N4535: length 32
  Top Layer w0.508: U3.7 72.52,22.76 73.03,23.27 C8.2
  Top Layer w0.762: 87.68,26.44 87.25,26.87 87.25,32.15 86.23,33.17 76.07,33.17 73.01,30.11 C7.2 73.01,24.85 C8.2
$1N4661: length 5.6
  Top Layer w0.762: U3.1 70.94,14.17 68.83,16.28 C9.1
$1N4713: length 15.4
  Top Layer w0.762: D3.1 65.91,20.03
  Top Layer w1.016: L1.2 59.44,15.64 61.21,17.42 64.13,17.42 65.91,19.2 65.91,20.03 66.02,20.13 68.73,20.13 C9.2 68.97,20.17 70.87,20.17
$1N5432: length 12.4
  Top Layer w0.508: R1.1 67.52,14.31 R2.2 68.78,14.36 70.96,12.18 74.04,12.18 75.18,13.32 75.18,14.04 U3.4
$1N8913: length 3.3
  Top Layer w0.762: R6.2 J1.1
$1N9223: length 3.2
  Top Layer w0.762: R7.2 J2.1
$1N9361: length 5.3
  Top Layer w0.762: 10.29,17.68 10.03,17.42 7.87,17.42 7.1,18.19 R8.2
$1N9905: length 3
  Top Layer w0.762: 8.92,54.89 11.95,54.89
$1N10187: length 11.4
  Top Layer w0.762: R11.2 R10.2 KEY_A.1 17.46,51.01 16.88,51.59 C22.1
$1N10465: length 13
  Top Layer w0.762: 20.02,38.63 KEY_B.1 17.65,38.82 17.65,41.93 16.61,42.97 C23.1 ; R12.2 R13.2
$1N10622: length 12
  Top Layer w0.762: C24.1 16.64,34.44 17.46,33.62 KEY_C.1 19.83,30.38 R14.2 19.95,34.06 R15.2
$1N14799: length 2.9
  Top Layer w0.762: 10.4,25.3 10.69,25.59 12.79,25.59 13.08,25.3

## Text on the board
Top Silkscreen Layer: 你说的队

# Board PCB1
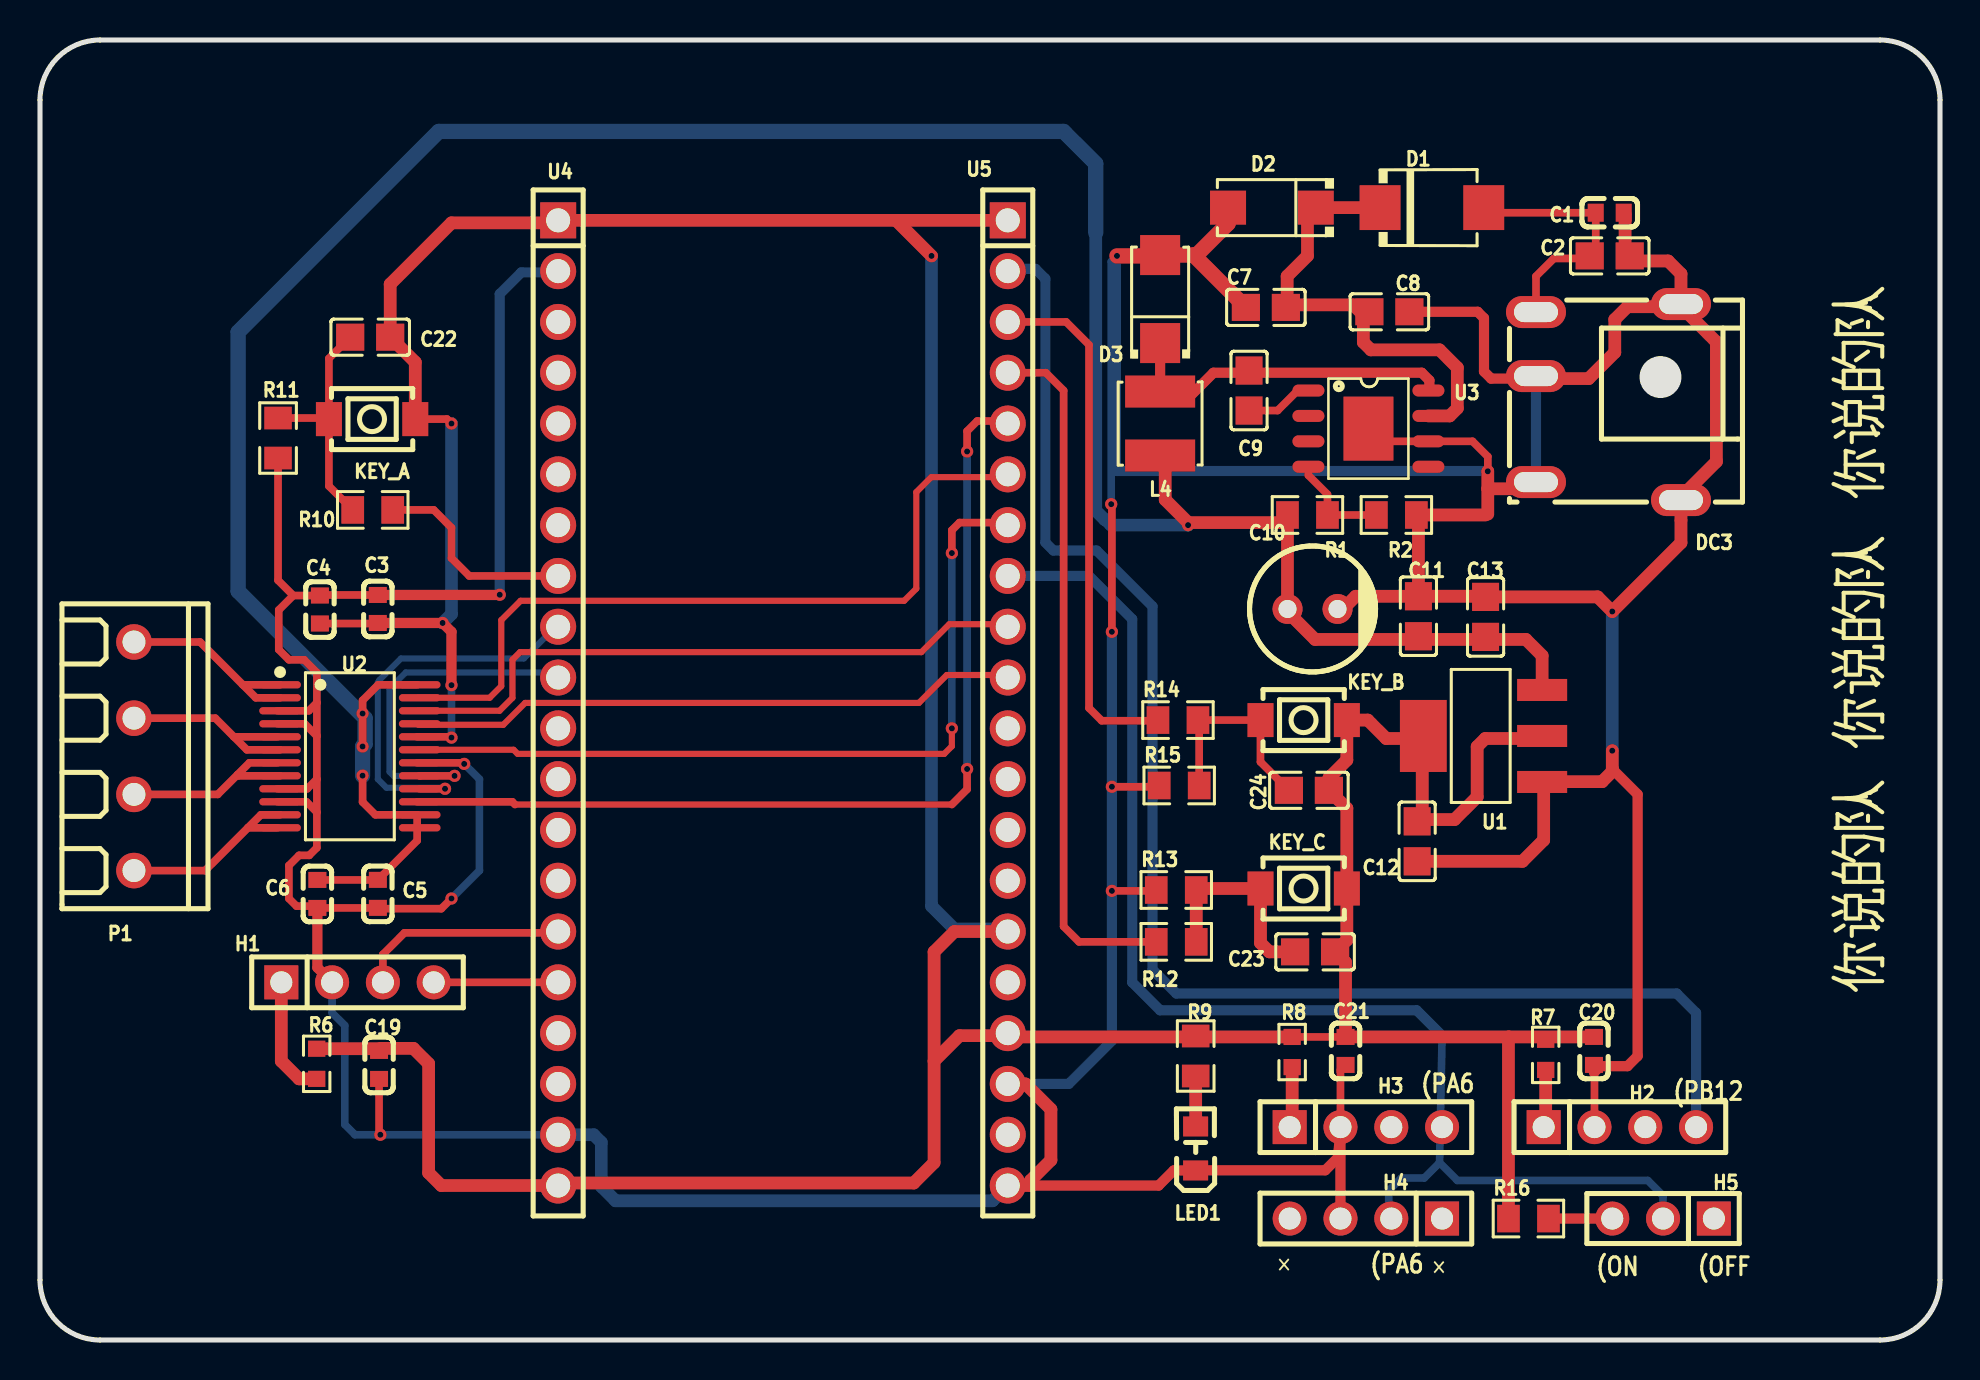
[diagram p3: board, top side]
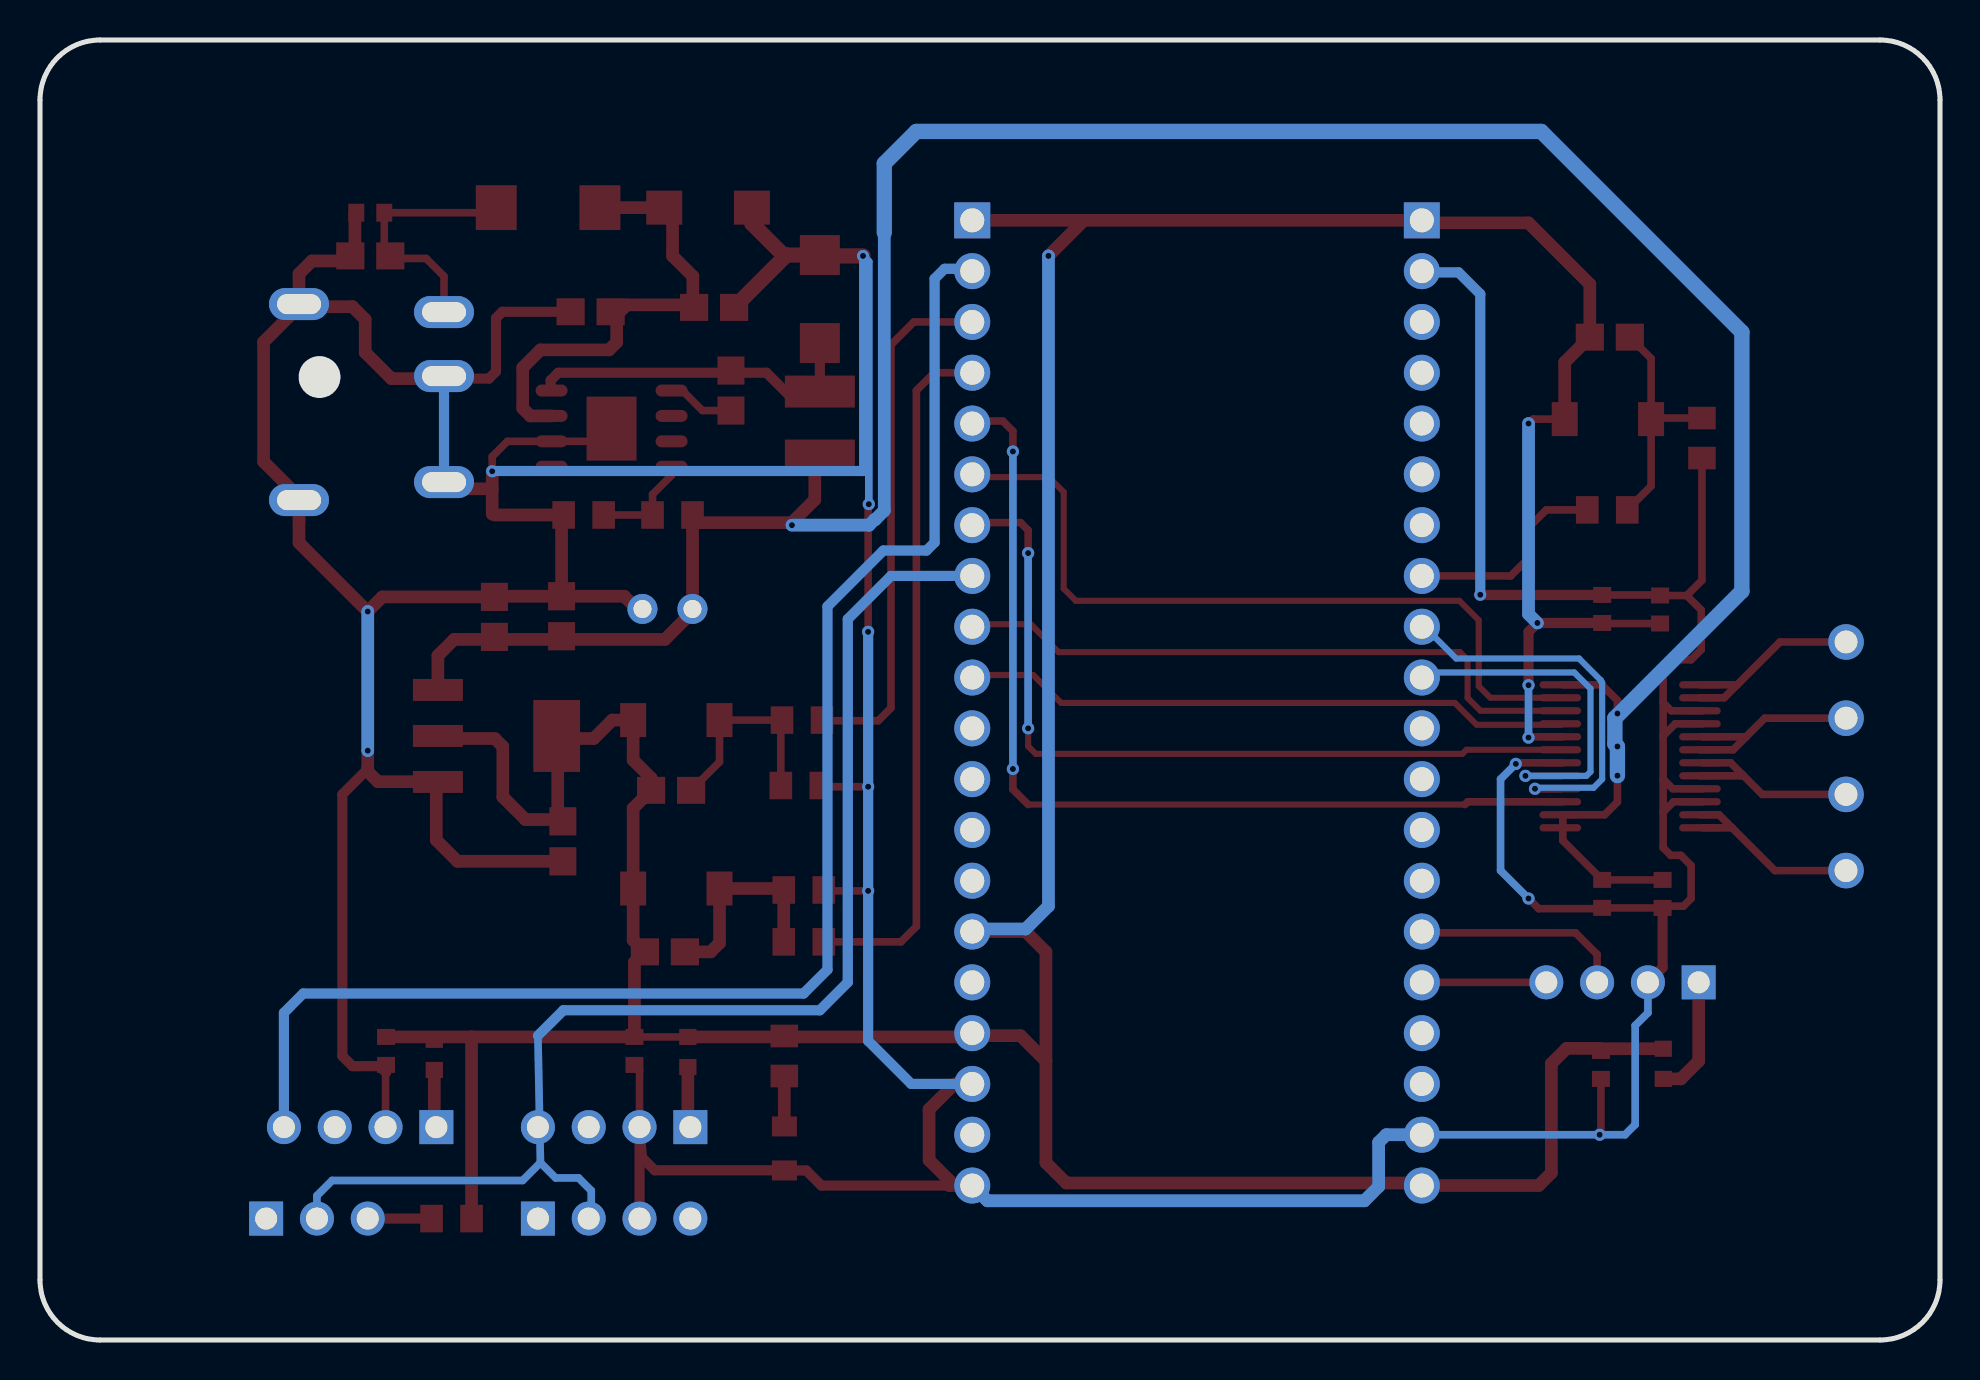
[diagram p4: board, bottom side, seen from below]

Outline 95 x 65 mm; copper layers: Top Layer, Bottom Layer. Coordinates in mm from the lower left corner of the outline.
Outline path: 0,62 0,3 arc(0.88,0.88) 3,0 92,0 arc(94.12,0.88) 95,3 95,62 arc(94.12,64.12) 92,65 3,65 arc(0.88,64.12) 0,62
Stack: Top Layer 0.035mm / Dielectric1 1.51mm FR4 er 4.5 / Bottom Layer 0.035mm

## Design rules (mm)
template: 自定义配置
spacing copperThickness1oz (default): track to track 0.102, other pairs 0.152 to 0.3
spacing copperThickness2oz: track to track 0.203, other pairs 0.152 to 0.3
track width copperThickness1oz: min 0.127, default 0.203, max 2.54
track width copperThickness2oz (default): min 0.203, default 0.381, max 1.016
differential pair differentialPair (default): width min 0.127, default 0.203, max 2.54; gap min 0.102, default 0.102
via viaSize (default): diameter min 0.5, default 0.61, max 10; hole min 0.3, default 0.305, max 6.3

## Placement (name value [footprint] x y rotation side)
C1  HNTC0603-104F3950FB  [C0603]  78.49 56.36 180 top
C2  22uF  [C0805]  78.49 54.2 180 top
C3  100nF  [C0603]  16.89 36.55 270 top
C4  10uF  [C0603]  14 36.52 270 top
C5  100nF  [C0603]  16.89 22.31 90 top
C6  10uF  [C0603]  13.87 22.3 90 top
C7  22uF  [C0805]  61.29 51.63 0 top
C8  100nF  [C0805]  67.47 51.41 180 top
C9  10nF  [C0805]  60.45 47.47 90 top
C10  220uF  [CAP-TH_BD6.3-P2.50-D0.5-FD]  63.63 36.55 0 top
C11  100nF  [C0805]  68.92 36.19 270 top
C12  10uF  [C0805]  68.86 24.93 90 top
C13  10uF  [C0805]  72.28 36.16 270 top
C19  100nF  [C0603]  16.95 13.75 90 top
C20  100nF  [C0603]  77.7 14.45 90 top
C21  100nF  [C0603]  65.28 14.45 90 top
C22  100nF  [C0805]  16.51 50.14 0 top
C23  100nF  [C0805]  63.75 19.41 0 top
C24  100nF  [C0805]  63.44 27.48 0 top
D1  SS510  [SMB_L4.3-W3.6-LS5.4-RD]  69.6 56.62 0 top
D2  SMAJ28A  [SMA_L4.4-W2.6-LS5.0-RD]  61.59 56.62 180 top
D3  B340A  [SMA_L4.3-W2.6-LS5.1-RD]  56.01 52.05 90 top
DC3  DC-044A-20A  [DC-IN-TH_DC-044A-20A]  78.42 46.9 180 top
H1  PM254V-11-04-H85  [HDR-TH_4P-P2.54-V-F]  15.88 17.88 0 top
H2  PM254V-11-04-H85  [HDR-TH_4P-P2.54-V-F]  78.99 10.64 0 top
H3  PM254V-11-04-H85  [HDR-TH_4P-P2.54-V-F]  66.29 10.64 0 top
H4  PM254V-11-04-H85  [HDR-TH_4P-P2.54-V-F]  66.29 6.07 180 top
H5  PZ254V-11-03P  [HDR-TH_3P-P2.54-V-M]  81.15 6.07 180 top
KEY_A  HX 3x4x2-2P-1.6N TACTILE SWITCH  [KEY-SMD_L4.0-W3.0-LS4.9-1]  16.61 46.05 0 top
KEY_B  HX 3x4x2-2P-1.6N TACTILE SWITCH  [KEY-SMD_L4.0-W3.0-LS4.9-1]  63.18 31 0 top
KEY_C  HX 3x4x2-2P-1.6N TACTILE SWITCH  [KEY-SMD_L4.0-W3.0-LS4.9-1]  63.18 22.58 0 top
L4  15uH  [IND-SMD_L4.0-W4.0]  56.01 45.82 90 top
LED1  LS R976-NR-1-0-20-R18  [LED_0805]  57.78 9.63 90 top
P1  WJ124-3.81-4P  [CONN-TH_4P-P3.81_KF124-3.81-4P]  4.7 29.19 180 top
R1  10kΩ  [R0805]  63.37 41.25 180 top
R2  3.24kΩ  [R0805]  67.82 41.25 180 top
R6  0Ω  [R0603]  13.83 13.81 270 top
R7  1Ω  [R0603]  75.28 14.26 270 top
R8  1Ω  [R0603]  62.61 14.4 270 top
R9  4.7kΩ  [R0805]  57.78 14.2 90 top
R10  1kΩ  [R0805]  16.64 41.5 180 top
R11  4.7kΩ  [R0805]  11.9 45.1 90 top
R12  1kΩ  [R0805]  56.81 19.91 0 top
R13  4.7kΩ  [R0805]  56.81 22.5 0 top
R14  1kΩ  [R0805]  56.9 31 0 top
R15  4.7kΩ  [R0805]  56.96 27.73 0 top
R16  10kΩ  [R0805]  74.42 6.07 0 top
U1  AMS1117-3.3  [SOT-223-3_L6.5-W3.4-P2.30-LS7.0-BR]  72.14 30.2 0 top
U2  TB6612FNG(O,C,8,EL  [SSOP-24_L8.4-W5.8-P0.65-LS7.8-BL]  15.49 29.19 270 top
U3  TPS5430DDARG4  [SO-8_L4.9-W3.9-P1.27-LS6.0-BL-EP]  66.42 45.57 270 top
U4  ZX-PM2.54-1-20PY  [HDR-TH_20P-P2.54-V-F]  25.91 31.85 270 top
U5  ZX-PM2.54-1-20PY  [HDR-TH_20P-P2.54-V-F]  48.39 31.85 270 top

## Footprints (pads in the part's own frame, mm; a bottom-side part is the same pattern mirrored in y, then rotated)
C0603
  rect 0.8x0.9 smd: 1(-0.7,0) 2(0.7,0)
C0805
  rect 1.41x1.35 smd: 1(-1,0) 2(1,0)
CAP-TH_BD6.3-P2.50-D0.5-FD
  round 1.5 hole 0.9: 1(-1.25,0) 2(1.25,0)
CONN-TH_4P-P3.81_KF124-3.81-4P
  round 1.778 hole 1.143: 1(0,5.715) 2(0,1.905) 3(0,-1.905) 4(0,-5.715)
DC-IN-TH_DC-044A-20A
  oval 3x1.6 hole 2.2x1: 1(3.625,-4.5) 2(3.625,4.001) 3(3.625,-1.3) 4(-3.625,-4.9) 5(-3.625,4.9)
HDR-TH_3P-P2.54-V-M
  rect 1.7x1.7 hole 1.1: 1(-2.54,0)
  round 1.7 hole 1.1: 2(0,0) 3(2.54,0)
HDR-TH_4P-P2.54-V-F
  rect 1.7x1.7 hole 1.1: 1(-3.81,0)
  round 1.7 hole 1.1: 2(-1.27,0) 3(1.27,0) 4(3.81,0)
HDR-TH_20P-P2.54-V-F
  rect 1.8x1.8 hole 1.2: 1(-24.13,0)
  round 1.8 hole 1.2: 2(-21.59,0) 3(-19.05,0) 4(-16.51,0) 5(-13.97,0) 6(-11.43,0) 7(-8.89,0) 8(-6.35,0) 9(-3.81,0) 10(-1.27,0) 11(1.27,0) 12(3.81,0) 13(6.35,0) 14(8.89,0) 15(11.43,0) 16(13.97,0) 17(16.51,0) 18(19.05,0) 19(21.59,0) 20(24.13,0)
IND-SMD_L4.0-W4.0
  rect 1.6x3.5 smd: 1(-1.6,0) 2(1.6,0)
KEY-SMD_L4.0-W3.0-LS4.9-1
  rect 1.3x1.7 smd: 1(-2.159,0) 2(2.159,0)
LED_0805
  rect 1x1.25 smd: 1(-1.15,0.005) 2(1.05,0.005)
R0603
  rect 0.806x0.864 smd: 1(-0.753,0) 2(0.753,0)
R0805
  rect 1.133x1.377 smd: 1(-1,0) 2(1,0)
SMA_L4.3-W2.6-LS5.1-RD
  rect 2x2 smd: 1(-2.2,0) 2(2.2,0)
SMA_L4.4-W2.6-LS5.0-RD
  rect 1.8x1.7 smd: 1(-2.192,0) 2(2.192,0)
SMB_L4.3-W3.6-LS5.4-RD
  rect 2.047x2.241 smd: 1(-2.591,0) 2(2.591,0)
SO-8_L4.9-W3.9-P1.27-LS6.0-BL-EP
  oval 0.6x1.6 smd: 1(-1.905,-3) 2(-0.635,-3) 3(0.635,-3) 4(1.905,-3) 5(1.905,3) 6(0.635,3) 7(-0.635,3) 8(-1.905,3)
  rect 3.2x2.5 smd: 9(0,0)
SOT-223-3_L6.5-W3.4-P2.30-LS7.0-BR
  rect 2.5x1.1 smd: 1(2.97,-2.3) 2(2.97,0) 3(2.97,2.3)
  rect 2.34x3.6 smd: 4(-2.97,0)
SSOP-24_L8.4-W5.8-P0.65-LS7.8-BL
  oval 0.364x2.082 smd: 1(-3.575,-3.491) 2(-2.925,-3.491) 3(-2.275,-3.491) 4(-1.625,-3.491) 5(-0.975,-3.491) 6(-0.325,-3.491) 7(0.325,-3.491) 8(0.975,-3.491) 9(1.625,-3.491) 10(2.275,-3.491) 11(2.925,-3.491) 12(3.575,-3.491) 13(3.575,3.491) 14(2.925,3.491) 15(2.275,3.491) 16(1.625,3.491) 17(0.975,3.491) 18(0.325,3.491) 19(-0.325,3.491) 20(-0.975,3.491) 21(-1.625,3.491) 22(-2.275,3.491) 23(-2.925,3.491) 24(-3.575,3.491)

## Nets
3V3: C3.2 C4.2 C12.2 C19.2 C20.2 C21.2 C22.2 C23.2 C24.2 KEY_A.2 KEY_B.2 KEY_C.2 R6.1 R7.1 R8.1 R9.2 R16.1 U1.2 U1.4 U2.20 U4.1 U4.20 U5.1 U5.15 U5.17
5V: C5.2 C6.2 C10.1 C11.2 C13.2 L4.1 R1.2 U1.3 U2.13 U2.14 U2.24
5V_USB: U5.19
12V: C1.2 C2.2 D1.2 DC3.1
GND: C1.1 C2.1 C3.1 C4.1 C5.1 C6.1 C7.1 C8.1 C10.2 C11.1 C12.1 C13.1 C19.1 C20.1 C21.1 D2.2 D3.2 DC3.2 DC3.3 DC3.4 DC3.5 H1.2 H2.2 H3.2 H4.3 LED1.1 R2.1 R11.1 R13.1 R15.1 U1.1 U2.3 U2.4 U2.9 U2.10 U2.18 U3.6 U3.9 U4.2 U4.19 U5.18 U5.20
AO1: P1.4 U2.1 U2.2
AO2: P1.3 U2.5 U2.6
BO1: P1.1 U2.11 U2.12
BO2: P1.2 U2.7 U2.8
PA0: U5.14
PA1: U5.13
PA2: U5.12
PA3: U5.11
PA4: U2.21 U5.10
PA5: U2.22 U5.9
PA6: H3.4 H4.2 H5.2 U5.8
PA7: U2.19 U5.7
PA8: U4.7
PA9: U4.5
PA10: U4.6
PA11: U4.3
PA12: U4.4
PA15: U4.11
PB0: U2.23 U5.6
PB1: U2.15 U5.5
PB3: U4.12
PB4: U4.13
PB5: U4.14
PB6: H1.3 U4.15
PB7: H1.4 U4.16
PB8: U4.17
PB9: U4.18
PB10: R12.1 U5.4
PB11: R14.1 U5.3
PB12: H2.4 U5.2
PB13: U2.17 U4.10
PB14: U2.16 U4.9
PB15: R10.1 U4.8
PC13: U5.16
$1N4535: C7.2 C8.2 D1.1 D2.1 U3.7
$1N4661: C9.1 U3.1
$1N4713: C9.2 D3.1 L4.2 U3.8
$1N5432: R1.1 R2.2 U3.4
$1N8913: H1.1 R6.2
$1N9223: H2.1 R7.2
$1N9361: H3.1 R8.2
$1N9905: LED1.2 R9.1
$1N10187: C22.1 KEY_A.1 R10.2 R11.2
$1N10465: C23.1 KEY_C.1 R12.2 R13.2
$1N10622: C24.1 KEY_B.1 R14.2 R15.2
$1N14799: H5.3 R16.2

Pads without a net: H2 3; H3 3; H4 1 4; H5 1; U3 2 3 5

## Via types
v1: diameter 0.61, hole 0.305, Top Layer to Bottom Layer, 27 vias

## Routing (per net, layer and track width the routed paths; a pad name or vN(x,y) marks a point on that pad's centre or on a via; arc(x,y) is an arc through that point)
3V3: length 233.7
  Top Layer w0.381: 18.86,30.16 20.53,30.16 v1(20.57,30.12) ; KEY_A.2 20.35,46.05 v1(20.57,45.82) ; C3.2 16.86,35.82 C4.2 ; C21.2 62.61,15.15 ; 69.04,30.08 U1.4
  Top Layer w0.508: C3.2 v1(20.13,35.85) 20.57,35.41 v1(20.57,32.74)
  Top Layer w0.635: 42.8,55.98 25.91,55.98 25.78,55.86 20.57,55.86 17.51,52.79 C22.2 18.76,48.89 KEY_A.2 ; 42.8,55.98 v1(44.58,54.2) ; 42.8,55.98 48.39,55.98 ; R16.1 73.42,15.14 73.44,15.15 ; 44.7,13.95 45.97,15.22 48.26,15.22 48.39,15.34 48.58,15.15 62.61,15.15 ; 44.7,13.95 44.7,8.87 43.69,7.85 26.03,7.85 U4.20 20.07,7.72 19.43,8.36 19.43,13.82 18.67,14.58 17.08,14.58 16.99,14.49 16.99,14.56 R6.1 ; 44.7,13.95 44.7,19.41 45.72,20.42 U5.15 ; 73.44,15.15 77.44,15.15 ; 73.44,15.15 C21.2 65.28,18.88 C23.2 65.34,20 KEY_C.2 65.34,26.59 C24.2 64.44,28.1 65.34,29 KEY_B.2 66.39,31 67.31,30.08 69.04,30.08 69.11,30 69.11,26.02 70.73,26.02 71.86,27.15 71.86,29.67 72.26,30.08 74.98,30.08
  Bottom Layer w0.381: v1(20.57,32.74) v1(20.57,30.12)
  Bottom Layer w0.635: U5.15 48.26,20.55 45.72,20.55 44.58,21.69 v1(44.58,54.2) ; v1(20.57,45.82) 20.57,36.3 v1(20.13,35.85)
5V: length 141
  Top Layer w0.381: v1(16.13,29.68) v1(16.13,31.32) 16.13,31.98 16.91,32.76 18.86,32.76 ; v1(16.13,28.22) 16.13,26.9 16.77,26.26 18.86,26.26 18.86,24.97 16.89,23.01 16.89,23 C6.2
  Top Layer w0.635: L4.1 56.26,43.97 56.26,42.01 57.4,40.87 61.99,40.87 R1.2 62.37,36.56 C10.1 62.38,36.41 63.75,35.03 68.76,35.03 C11.2 69.08,35.03 74.29,35.03 75.11,34.22 U1.3
  Bottom Layer w0.635: v1(57.4,40.74) 53.55,40.74 53.27,41.02 53.24,41.02 52.79,41.47 52.79,55.37
  Bottom Layer w0.762: 52.79,55.37 52.79,58.82 51.18,60.43 19.94,60.43 9.91,50.39 9.91,37.44 16.26,31.09 16.26,29.8 v1(16.13,29.68) v1(16.13,28.22)
12V: length 12.9
  Top Layer w0.381: DC3.1 74.8,53.19 75.69,54.08 77.36,54.08 C2.2 77.79,54.5 C1.2 72.44,56.36 D1.2
GND: length 379.1
  Top Layer w0.381: 12.66,37.22 C4.1 14.02,37.25 C3.1 ; 12.66,37.22 11.94,36.5 11.94,34.52 12.45,34.01 13.21,34.01 13.84,33.38 13.84,31.86 ; 12.66,37.22 11.9,37.98 R11.1 ; C19.1 16.95,10.33 v1(17.02,10.26) ; U3.9 67.06,44.93 U3.6 71.63,44.93 72.39,44.17 v1(72.39,43.44) ; 13.84,30.2 13.84,28.04 ; 13.84,30.2 13.84,31.86 ; 13.84,30.2 13.23,30.81 11.88,30.81 ; 13.84,28.04 13.84,26.39 ; 13.84,28.04 13.36,27.56 11.88,27.56 ; H3.2 65.02,13.5 C21.1 ; v1(53.59,27.66) 55.9,27.66 R15.1 ; 11.88,31.46 13.44,31.46 13.84,31.86 ; 11.88,26.91 13.32,26.91 13.84,26.39 ; 13.84,26.39 13.84,24.61 13.46,24.23 12.95,24.23 12.45,23.72 12.45,22.07 12.83,21.69 13.78,21.69 C6.1 16.89,21.6 C5.1 16.93,21.57 20.07,21.57 v1(20.57,22.07) ; 77.72,13.22 H2.2 ; R13.1 55.77,22.46 v1(53.59,22.46) ; 18.86,28.86 21.15,28.86 v1(21.21,28.81) ; 53.59,41.7 v1(53.59,35.41)
  Top Layer w0.508: LED1.1 56.69,8.48 55.93,7.72 49.53,7.72 ; 57.9,8.36 58.03,8.48 64.26,8.48 64.9,9.12 65.02,10.52 ; H1.2 13.87,18.62 C6.1 ; 65.02,10.52 H3.2 ; 65.02,10.52 H4.3 ; C8.1 71.88,51.41 72.2,51.09 72.2,48.43 72.56,48.07 74.8,48.07 ; v1(22.99,37.26) 22.98,37.25 C3.1 ; 78.62,28.54 79.88,27.28 79.88,14.2 79.38,13.69 78.02,13.69 77.7,13.37
  Top Layer w0.635: 74.8,48.07 77.43,48.07 78.74,49.38 78.74,51.03 79.38,51.67 82.04,51.67 82.05,51.67 ; U5.18 49.28,12.8 50.55,11.53 50.55,8.99 49.53,7.98 49.53,7.72 U5.20 ; 72.39,42.56 74.59,42.56 74.8,42.77 ; 72.39,42.56 v1(72.39,43.44) ; 72.39,42.56 72.39,41.3 ; C11.1 71.86,37.19 71.9,37.16 77.88,37.16 v1(78.61,36.42) 82.05,39.86 82.05,42.15 83.82,43.92 83.82,49.9 82.05,51.67 ; C11.1 65.79,37.19 65.15,36.55 C10.2 ; C11.1 68.92,41.15 R2.1 72.27,41.25 ; 82.05,51.67 82.05,53.31 81.41,53.95 79.46,53.95 79.25,54.16 79.25,56.3 C1.1 ; v1(78.61,29.47) 78.61,28.53 78.62,28.54 78.62,28.44 78.1,27.92 75.12,27.92 U1.1 75.18,27.82 75.18,25 74.12,23.93 C12.1
  Top Layer w0.762: 57.68,54.25 57.83,54.25 59.4,55.82 D2.2 ; 57.68,54.25 C7.1 ; 57.68,54.25 D3.2 55.97,54.2 v1(53.85,54.2)
  Bottom Layer w0.381: v1(20.57,22.07) 21.97,23.47 21.97,28.04 v1(21.21,28.81) ; 25.91,10.26 v1(17.02,10.26) 15.75,10.26 15.24,10.77 15.24,15.72 14.61,16.36 H1.2 ; v1(53.56,41.79) 53.56,53.92 53.79,54.15
  Bottom Layer w0.508: v1(22.99,37.26) 22.99,52.3 24.07,53.38 25.84,53.38 U4.2 ; v1(53.85,54.2) 53.79,54.15 53.79,43.51 53.85,43.45 72.37,43.45 v1(72.39,43.44) ; U5.18 51.44,12.8 53.59,14.96 v1(53.59,22.46) v1(53.59,27.66) v1(53.59,35.41) ; 74.8,48.07 74.8,42.77
  Bottom Layer w0.635: U5.20 47.63,6.96 28.78,6.96 28.07,7.67 28.07,9.88 27.69,10.26 25.91,10.26 ; v1(78.61,36.42) v1(78.61,29.47)
AO1: length 10.3
  Top Layer w0.381: U2.2 10.79,32.11 10.14,32.76 ; 10.14,32.76 8,34.9 4.7,34.9 ; 10.14,32.76 12,32.76
AO2: length 10
  Top Layer w0.381: 9.69,30.16 10.34,29.51 U2.6 ; 9.69,30.16 8.76,31.09 4.83,31.09 ; 9.69,30.16 11.88,30.16
BO1: length 9.8
  Top Layer w0.381: 10.39,25.61 11.05,26.26 12,26.26 ; 10.39,25.61 11.88,25.61 ; 10.39,25.61 8.25,23.47 4.83,23.47
BO2: length 9.9
  Top Layer w0.381: 4.83,27.28 8.89,27.28 9.88,28.27 ; 11.88,28.86 10.47,28.86 9.88,28.27 ; 9.88,28.27 9.94,28.21 U2.8
PA4: length 30.6
  Top Layer w0.203: 48.26,33.25 48.39,33.12 ; 18.86,30.81 18.91,30.76
  Top Layer w0.305: 48.26,33.25 45.34,33.25 43.94,31.85 24.26,31.85 23.16,30.76 18.91,30.76
PA5: length 32.5
  Top Layer w0.305: 18.86,31.46 22.98,31.46 23.62,32.11 23.62,34.01 24,34.39 44.07,34.39 45.47,35.79 48.26,35.79 U5.9
PA6: length 65.8
  Bottom Layer w0.381: 69.98,8.87 70.87,7.98 80.39,7.98 81.15,7.22 H5.2 ; 69.98,8.87 69.22,8.1 68.07,8.1 67.44,7.47 67.44,6.2 H4.2 ; 69.98,8.87 70.1,15.22
  Bottom Layer w0.508: 48.39,38.2 52.45,38.2 54.61,36.04 54.61,17.88 56.01,16.49 68.83,16.49 70.1,15.22
PA7: length 40.8
  Top Layer w0.305: 18.86,29.51 23.68,29.51 23.88,29.31 45.21,29.31 45.59,29.69 v1(45.59,30.58)
  Top Layer w0.381: U5.7 48.26,40.87 45.97,40.87 45.59,40.49 v1(45.59,39.35)
  Bottom Layer w0.381: v1(45.59,30.58) v1(45.59,39.35)
PB0: length 38.9
  Top Layer w0.305: 48.39,43.28 48.25,43.14 44.56,43.14 43.81,42.39 43.81,37.57 43.21,36.96 24.03,36.96 23.06,35.99 23.06,32.69 22.48,32.11 18.86,32.11
PB1: length 48.1
  Top Layer w0.305: 23.75,26.77 45.59,26.77
  Top Layer w0.381: U5.5 48.26,45.95 46.86,45.95 46.35,45.44 v1(46.35,44.43) ; 23.75,26.77 23.61,26.91 18.86,26.91 ; 45.59,26.77 46.35,27.53 v1(46.35,28.55)
  Bottom Layer w0.381: v1(46.35,44.43) v1(46.35,28.55)
PB6: length 10.6
  Top Layer w0.381: U4.15 25.84,20.36 18.22,20.36 17.14,19.28 H1.3
PB7: length 6.2
  Top Layer w0.381: H1.4 U4.16
PB10: length 34.9
  Top Layer w0.381: R12.1 51.95,19.91 51.18,20.68 51.18,47.47 50.29,48.36 U5.4
PB11: length 26.4
  Top Layer w0.381: R14.1 55.87,30.96 53.09,30.96 52.45,31.6 52.45,49.76 51.31,50.9 48.39,50.9
PB12: length 73.9
  Bottom Layer w0.508: U5.2 48.5,53.56 49.77,53.56 50.27,53.06 50.27,39.88 50.67,39.47 52.83,39.47 55.63,36.68 55.63,18.52 56.82,17.32 81.84,17.32 82.8,16.36 H2.4
PB13: length 18.1
  Top Layer w0.381: v1(20.73,28.21) 18.99,28.21 U2.17
  Bottom Layer w0.305: v1(20.73,28.21) 17.68,28.21 17.47,28.41 17.47,32.56 18.29,33.38 25.53,33.38 25.78,33.12 25.91,33.12
PB14: length 19.9
  Top Layer w0.381: U2.16 v1(20.25,27.56)
  Bottom Layer w0.305: v1(20.25,27.56) 20.2,27.61 17.32,27.61 16.89,28.04 16.89,32.87 16.97,32.94 16.97,33 18.05,34.08 24.19,34.08 25.78,35.66 U4.9
PB15: length 10.5
  Top Layer w0.381: 25.91,38.2 21.46,38.2 20.57,39.09 20.57,40.62 19.69,41.5 R10.1
$1N4535: length 23.3
  Top Layer w0.508: C7.2 62.36,51.69
  Top Layer w0.635: U3.7 70.49,46.2 70.87,46.58 70.87,48.62 69.98,49.51 66.55,49.51 66.17,49.89 66.17,51.25 65.66,51.76 62.42,51.76 62.36,51.69 62.36,53.19 63.37,54.2 63.37,56.62 D2.1 D1.1
$1N4661: length 3.4
  Top Layer w0.381: C9.1 61.88,46.47 62.88,47.47 U3.1
$1N4713: length 17.6
  Top Layer w0.381: 56.24,49.62 D3.1
  Top Layer w0.508: U3.8 69.47,47.52 69.47,47.98 69.09,48.36 60.56,48.36 C9.2 60.34,48.36 58.67,48.36 57.48,47.17 56.26,47.17 56.01,47.42 D3.1
$1N5432: length 5.3
  Top Layer w0.381: U3.4 63.42,43.23 64.37,42.28 R1.1 R2.2
$1N8913: length 6.1
  Top Layer w0.635: R6.2 12.95,13.06 12.06,13.95 H1.1
$1N9223: length 2.8
  Top Layer w0.635: H2.1 75.28,10.74 75.28,13.38
$1N9361: length 3.1
  Top Layer w0.635: R8.2 62.61,10.77 H3.1
$1N9905: length 2.5
  Top Layer w0.635: LED1.2 57.78,10.68 R9.1
$1N10187: length 12.1
  Top Layer w0.381: R10.2 14.45,42.7 KEY_A.1 ; C22.1 14.45,49.08 KEY_A.1 ; KEY_A.1 14.39,46.1 R11.2
$1N10465: length 10.3
  Top Layer w0.635: 57.81,20.09 57.81,22.58 KEY_C.1 61.02,19.85 61.47,19.41 C23.1
$1N10622: length 10.5
  Top Layer w0.381: R15.2 57.96,30.93 R14.2 KEY_B.1 61.02,28.9 C24.1
$1N14799: length 2.9
  Top Layer w0.508: R16.2 78.36,6.07

## Text on the board
Top Silkscreen Layer: (PA6 | (ON | (PB12 | (OFF | × | 你说的队
